# EasyEDA Pro project 智能环境检测系统.epro

# Schematic 原理图
Create Date: 2024-04-26; Page Name: P1; Project Name: WIFI  空气温湿度 oled 土壤 光敏; Schematic Name: 原理图; Update Date: 2024-10-24; Company: 嘉立创EDA; Page Size: A4; Version: V1.0
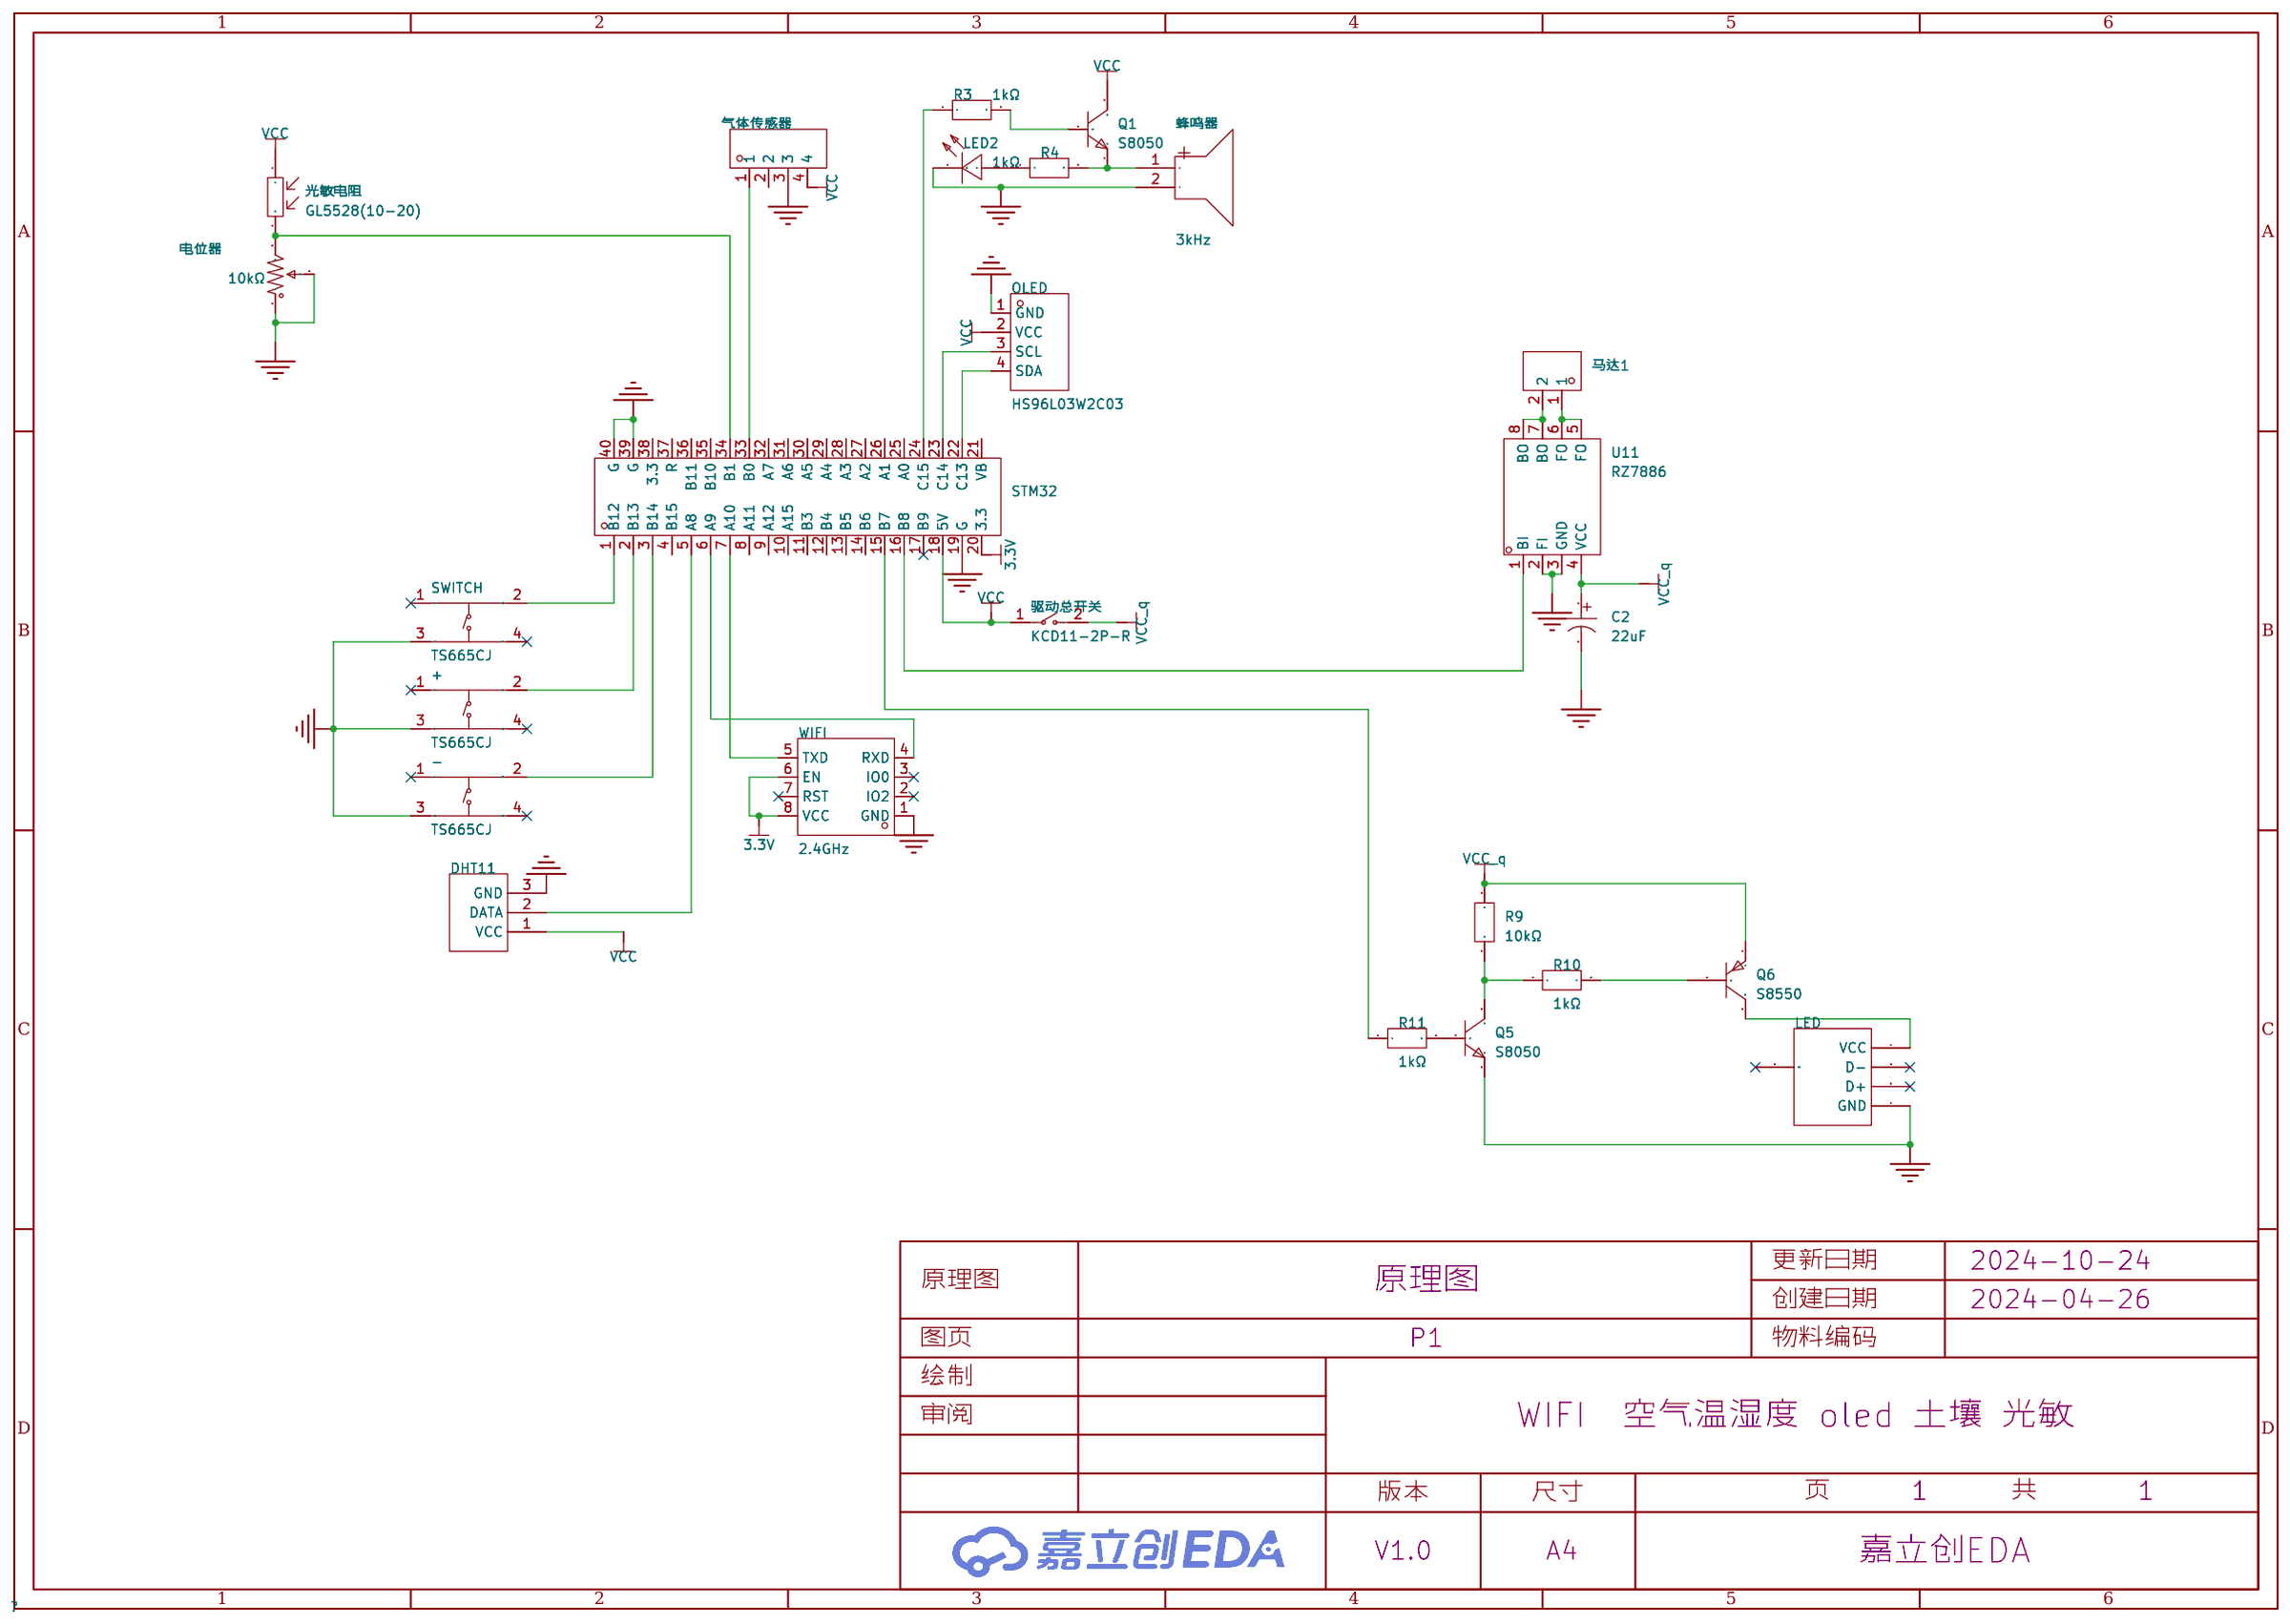
[diagram p0: schematic sheet]

## Parts
+  TS665CJ  [SW-TH_4P-L6.0-W6.0-P4.50-LS6.5]
-  TS665CJ  [SW-TH_4P-L6.0-W6.0-P4.50-LS6.5]
C2  22uF  [CAP-TH_BD5.0-P2.00-D0.8-FD]
DHT11  -  [HDR-M-2.54_1X3]
LED  AF 90° WJDG  [USB-A-TH_AF-WJDG]
LED2  204-10SDRD/S530-A3/F182-68  [LED-TH_BD4.0-P2.50-RD]
OLED  HS96L03W2C03  [OLED-TH_L27.8-W27.2-P2.54_C9900033791]
Q1  S8050  [TO-92-3_L4.5-W3.5-P1.27-L]
Q5  S8050  [TO-92-3_L4.5-W3.5-P1.27-L]
Q6  S8550  [TO-92-3_L4.5-W3.5-P1.27-L]
R3  1kΩ  [RES-TH_BD2.3-L6.5-P10.50-D0.5]
R4  1kΩ  [RES-TH_BD2.3-L6.5-P10.50-D0.5]
R9  10kΩ  [RES-TH_BD2.4-L6.3-P10.30-D0.6]
R10  1kΩ  [RES-TH_BD2.3-L6.5-P10.50-D0.5]
R11  1kΩ  [RES-TH_BD2.3-L6.5-P10.50-D0.5]
STM32  -  [DIP-40_L50.8-W17.8-P2.54-LS15.2-BL]
SWITCH  TS665CJ  [SW-TH_4P-L6.0-W6.0-P4.50-LS6.5]
U11  RZ7886  [DIP-8_L10.0-W6.5-P2.54-LS7.6-BL]
WIFI  2.4GHz  [WIFIM-TH_8P-L24.7-W14.4-P2.54]
光敏电阻  GL5528(10-20)  [RES-TH_L5.1-W4.3-P3.40-D0.5]
气体传感器  -  [HDR-TH_4P-P2.54-V-M]
电位器  10kΩ  [RES-ADJ-TH_3362P]
蜂鸣器  3kHz  [BUZ-TH_BD9.0-P5.00-D0.6-FD]
马达1  MX126-5.0-02P-GN01-Cu-S-A  [CONN-TH_2P-P5.00_MX126-5.0-GN01-02P-CU-S-A]
驱动总开关  KCD11-2P-R  [SW-TH_2P-L15.0-W10.5-P5.00_KCD11-2P-R]

## Library data of the parts
+ - SWITCH = TS665CJ: 电路结构:单刀单掷;按钮形状:圆形按钮;安装方式:直插;开关长度:6mm;开关宽度:6mm;开关高度:5mm;触点电流:50mA;额定电压(DC):12V;带灯:-;机械寿命:-;; LCSC Part Name: 6*6*5mm 直插 轻触开关; Supplier Part: C393938; Manufacturer: SHOU HAN(首韩); Supplier Footprint: 插件; JLCPCB Part Class: 扩展库; Datasheet: https://atta.szlcsc.com/upload/public/pdf/source/20190521/C393938_BDABEAC600B4C55E200A80AA129B70BC.pdf; Supplier: LCSC; Circuit: 单刀单掷; Actuator Style: 圆形按钮; Mounting Style: 直插; Switch Length: 6mm; Switch Width: 6mm; Switch Height: 5mm; Contact Current: 50mA; Voltage Rating (DC): 12V
C2 = KM220M050C110A: 容值:22uF;精度:±20%;额定电压:50V;; LCSC Part Name: 22uF ±20% 50V; Supplier Part: C59385; Manufacturer: CapXon(丰宾); Supplier Footprint: 插件,D5xL11mm; JLCPCB Part Class: 扩展库; Datasheet: https://atta.szlcsc.com/upload/public/pdf/source/20150922/1457707409519.pdf; Supplier: LCSC; Tolerance: ±20%; Rated Voltage: 50V; Lead Spacing: 2mm; φD: 5mm; L: 11mm; Lifetime @ Temp: 2000hrs@105℃
DHT11 = dht11模块
LED = AF 90° WJDG: 连接器类型:Type-A;标准:USB 2.0;公母:母;端口数量:1;触点数量:4P;安装方式:弯插;额定电流 - 电源:1.5A;工作温度范围:-25℃~+85℃;; LCSC Part Name: Type-A 母 弯插; Supplier Part: C456018; Manufacturer: SHOU HAN(首韩); Supplier Footprint: 插件; JLCPCB Part Class: 扩展库; Datasheet: https://atta.szlcsc.com/upload/public/pdf/source/20191113/C456018_B104E062BEB8E11E57E63560E04EE13A.pdf; Supplier: LCSC; Connector Type: Type-A; Standard: USB 2.0; Gender: 母; Number of Ports: 1; Number of Contacts: 4P; Mounting Style: 弯插; Current Rating - Power (Max): 1.5A; Operating Temperature Range: -25℃~+85℃
LED2 = 204-10SDRD/S530-A3/F182-68: Supplier Part: C473831; Manufacturer: EVERLIGHT(亿光); Supplier Footprint: 插件; JLCPCB Part Class: 扩展库; Supplier: LCSC
OLED = HS96L03W2C03: 主控芯片:SSD1315;接口类型:I2C;尺寸(inch):0.96;像素分辨率:128x64;; LCSC Part Name: 0.96寸OLED显示屏窄白光IIC; Supplier Part: C5248080; Manufacturer: HS(汉昇); JLCPCB Part Class: 扩展库; Datasheet: https://atta.szlcsc.com/upload/public/pdf/source/20230627/763D01F79A90007632F098068C7C8AD9.pdf; Supplier: LCSC; Main Control Chip: SSD1315; Interface Type: I2C; Size: 0.96; Pixel Resolution: 128x64; Operating Temperature: -40℃~+70℃
Q1 Q5 = S8050_C2931492: 晶体管类型:NPN;集电极电流(Ic):500mA;集射极击穿电压(Vceo):25V;功率(Pd):625mW;直流电流增益(hFE@Ic,Vce):160@50mA,1V;; LCSC Part Name: NPN 电流:500mA 耐压:25V; Supplier Part: C2931492; Manufacturer: JSMSEMI(杰盛微); Supplier Footprint: TO-92-3; JLCPCB Part Class: 扩展库; Datasheet: https://atta.szlcsc.com/upload/public/pdf/source/20240105/D4E57AD221AC7DEA1E31B953388D993E.pdf; Supplier: LCSC; Transistor Type: NPN; Collector Current (Ic): 500mA; Collector-Emitter Breakdown Voltage (Vceo): 25V; Power Dissipation (Pd): 625mW; DC Current Gain (hFE@Ic,Vce): 160@50mA,1V; Transition Frequency (fT): 150MHz; Collector Cut-Off Current (Icbo): 100nA; Collector-Emitter Saturation Voltage (VCE(sat)@Ic,Ib): 600mV@500mA,50mA
Q6 = S8550_C2931493: 晶体管类型:PNP;集电极电流(Ic):500mA;集射极击穿电压(Vceo):25V;功率(Pd):625mW;直流电流增益(hFE@Ic,Vce):160@50mA,1V;; LCSC Part Name: PNP 电流:500mA 耐压:25V; Supplier Part: C2931493; Manufacturer: JSMSEMI(杰盛微); Supplier Footprint: TO-92-3; JLCPCB Part Class: 扩展库; Datasheet: https://atta.szlcsc.com/upload/public/pdf/source/20240105/F52EC9AE03FE5F64272EDBFE24453978.pdf; Supplier: LCSC; Transistor Type: PNP; Collector Current (Ic): 500mA; Collector-Emitter Breakdown Voltage (Vceo): 25V; Power Dissipation (Pd): 625mW; DC Current Gain (hFE@Ic,Vce): 160@50mA,1V; Transition Frequency (fT): 150MHz; Collector Cut-Off Current (Icbo): 100nA; Collector-Emitter Saturation Voltage (VCE(sat)@Ic,Ib): 600mV@500mA,50mA
R3 R4 R10 R11 = MF1/4W-1KΩ±1%T52: 电阻类型:金属膜电阻;阻值:1kΩ;精度:±1%;功率:250mW;温度系数:±200ppm/℃;; LCSC Part Name: 金属膜电阻 1kΩ ±1% 250mW; Supplier Part: C713997; Manufacturer: 华星机电; Supplier Footprint: 插件; JLCPCB Part Class: 扩展库; Datasheet: https://atta.szlcsc.com/upload/public/pdf/source/20200731/C713882_AE8EB1102749D7E4FB4FB13DC898C429.pdf; Supplier: LCSC; Type: 金属膜电阻; Tolerance: ±1%; Power(Watts): 250mW; Temperature Coefficient: ±200ppm/℃
R9 = RN1/4W10KFT/BA1: 电阻类型:金属膜电阻;阻值:10kΩ;精度:±1%;功率:250mW;温度系数:±50ppm/℃;; LCSC Part Name: 10kΩ ±1% 250mW 金属膜电阻; Supplier Part: C410695; Manufacturer: Tyohm(幸亚电阻); Supplier Footprint: 插件; JLCPCB Part Class: 扩展库; Datasheet: https://atta.szlcsc.com/upload/public/pdf/source/20190808/C410699_D126E64D28B638F1D73B58E9F61DFD9B.pdf; Supplier: LCSC; Type: 金属膜电阻; Tolerance: ±1%; Overload Voltage (Max): 250V; Power(Watts): 250mW; Temperature Coefficient: ±50ppm/℃; Operating Temperature Range: -55℃~+125℃
STM32 = stm32扩展板
U11 = RZ7886: 马达驱动; Supplier Part: C128852; Manufacturer: RZ(睿智微); Supplier Footprint: DIP-8; JLCPCB Part Class: 扩展库; Datasheet: https://atta.szlcsc.com/upload/public/pdf/source/20180613/C128852_BAAE7924E869DB4853C0D962680B5688.pdf; Supplier: LCSC
WIFI = ESP-01S: 核心处理器:ESP8266芯片;频率:2.4GHz;天线形式:板载PCB天线;发射功率:16dBm;接收灵敏度:-90dBm;; LCSC Part Name: 完整的802.11b/g/nWi-FiSoC模块; Supplier Part: C503582; Manufacturer: Ai-Thinker(安信可); JLCPCB Part Class: 扩展库; Datasheet: https://atta.szlcsc.com/upload/public/pdf/source/20200407/C503582_1139AF8FB42E05635FA0089E1752A536.pdf; Supplier: LCSC; Core Processor: ESP8266芯片; Support Interface: GPIO；UART；PWM; Antenna Type: 板载PCB天线; Output Power: 16dBm; Operating Voltage: 3V~3.6V; Receive  Current: 56mA; Send  Current: 170mA; Sensitivity: -90dBm; Operating Temperature: -20℃~+70℃
光敏电阻 = GL5528(10-20)_C10081: 暗电阻:1MΩ;亮电阻 @ 10Lux:10kΩ~20kΩ;光谱峰值(波长):540nm;; LCSC Part Name: 亮电阻:10kΩ~20kΩ 暗电阻:1MΩ; Supplier Part: C10081; Manufacturer: JCHL(晶创和立); Supplier Footprint: 插件,P=3.4mm; JLCPCB Part Class: 扩展库; Datasheet: https://atta.szlcsc.com/upload/public/pdf/source/20200417/C515010_C10502EF7F431E893A7F20DB83F527F0.pdf; Supplier: LCSC; Dark Resistance: 1MΩ; Illuminated Resistance @ 10Lux: 10kΩ~20kΩ; Applied Voltage: 150V; Spectral Peak: 540nm
气体传感器 = HDR-M_2.54_1x4P: Supplier Part: C492403; Supplier Footprint: 插件
电位器 = 3362P-1-103: 阻值:10kΩ;精度:±10%;; LCSC Part Name: 10kΩ ±10%; Supplier Part: C118956; Manufacturer: BOCHEN(博晨); Supplier Footprint: 插件; JLCPCB Part Class: 扩展库; Datasheet: https://atta.szlcsc.com/upload/public/pdf/source/20171114/C118956_15106326650691117445.pdf; Supplier: LCSC; Tolerance: ±10%
蜂鸣器 = HNB09A03: 驱动方式:有源(内含驱动线路);构造类型:电磁式;频率:3kHz;声压(SPL):85dB@10cm;; LCSC Part Name: 电磁式有源一体蜂鸣器HNB09A03; Supplier Part: C96102; Manufacturer: 华能; Supplier Footprint: 插件,D=9mm; JLCPCB Part Class: 扩展库; Datasheet: https://atta.szlcsc.com/upload/public/pdf/source/20170522/1495448326172.pdf; Supplier: LCSC; Oscillator Circuit: 有源(内含驱动线路); Technology Type: 电磁式; Operating Voltage: 1.5V~4.5V; Current Consumption: 30mA; Sound Pressure Level (SPL): 85dB@10cm; Diameter (φD): 9mm; Height: 5.5mm; Operating Temperature: -20℃~+70℃
马达1 = MX126-5.0-02P-GN01-Cu-S-A: 结构:1x2P;间距:5mm;颜色:绿色;安装方式:直插;额定电流:10A;额定电压:300V;排数:1;线规 - AWG:14~26;线规 - 平方毫米:2.5;每排PIN数:2;触头材质:铜合金;触头镀层:锡;工作温度范围:-40℃~+105℃;; LCSC Part Name: 5mm 1x2P 排数:1 每排P数:2 直插; Supplier Part: C5188434; Manufacturer: MAX(迈旭); Supplier Footprint: 插件,P=5mm; JLCPCB Part Class: 扩展库; Datasheet: https://atta.szlcsc.com/upload/public/pdf/source/20230914/2B012B5258BE925E2417FA81B30CB923.pdf; Supplier: LCSC; Structure: 1x2P; Pitch: 5mm; Color: 绿色; Mounting Style: 直插; Current Rating (Max): 10A; Voltage Rating (Max): 300V; Number of Pins: 2P; Number of Rows: 1; Wire Gauge - AWG: 14~26; Wire Gauge - mm2: 2.5; Number of PINs Per Row: 2; Contact Material: 铜合金; Contact Plating: 锡; Operating Temperature Range: -40℃~+105℃
驱动总开关 = KCD11-2P-R: 带灯:无;引脚样式:焊片;额定电流:3A;额定电压(AC):250V;额定电压(DC):-;电路结构:单刀单掷;机械寿命:1万次;; LCSC Part Name: 10.5*15mm 两脚两档跷板开关 红钮; Supplier Part: C5884414; Manufacturer: SHOU HAN(首韩); Supplier Footprint: 插件; JLCPCB Part Class: 扩展库; Datasheet: https://atta.szlcsc.com/upload/public/pdf/source/20230506/CD06DFDE35C8048D34175BFF4AF6A2C2.pdf; Supplier: LCSC; Switch Length: 15mm; Switch Width: 10.5mm; Switch Height: 17.2mm; Actuator Type: 凹面弯曲; With Lamp: 无; Pin Style: 焊片; Actuator Color: 红色; Contact Current: 3A; Voltage Rating (AC): 250V; Circuit: 单刀单掷; Mechanical Life: 1万次; Operating Temperature: 0℃~+125℃; Actuator Identifier: - O

## Nets
3.3V: STM32.20(3.3) WIFI.6(EN) WIFI.8(VCC)
GND: +.3(C) -.3(C) C2.2 DHT11.3(GND) LED.4(GND) LED2.1(C) OLED.1(GND) Q5.1(E) STM32.19(G) STM32.39(G) STM32.40(G) SWITCH.3(C) U11.2(FI) U11.3(GND) WIFI.1(GND) 气体传感器.3 电位器.1 电位器.2 蜂鸣器.2(-)
VCC: DHT11.1(VCC) OLED.2(VCC) Q1.3(C) STM32.18(5V) 光敏电阻.1 气体传感器.4 驱动总开关.1
VCC_q: C2.1 Q6.1(E) R9.2 U11.4(VCC) 驱动总开关.2
$1N3228: STM32.33(B0) 气体传感器.1
$1N3444: Q1.2(B) R3.2
$1N3528: Q1.1(E) R4.2 蜂鸣器.1(+)
$1N3532: LED2.2(A) R4.1
$1N3767: OLED.3(SCL) STM32.23(C14)
$1N3771: OLED.4(SDA) STM32.22(C13)
$1N3839: R3.1 STM32.24(C15)
$1N4349: STM32.1(B12) SWITCH.2(B)
$1N4353: +.2(B) STM32.2(B13)
$1N4357: -.2(B) STM32.3(B14)
$1N4558: DHT11.2(DATA) STM32.5(A8)
$1N4725: STM32.6(A9) WIFI.4(RXD)
$1N4730: STM32.7(A10) WIFI.5(TXD)
$1N5233: Q6.2(B) R10.2
$1N5238: Q5.3(C) R9.1 R10.1
$1N5242: Q5.2(B) R11.2
$1N6355: R11.1 STM32.15(B7)
$1N6554: STM32.34(B1) 光敏电阻.2 电位器.3
$1N12132: LED.1(VCC) Q6.3(C)
$1N15975: STM32.16(B8) U11.1(BI)
$1N16897: U11.7(BO) U11.8(BO) 马达1.2
$1N16901: U11.5(FO) U11.6(FO) 马达1.1

Not connected (* = marked no-connect by the designer): + 1(A)* 4(D)*; - 1(A)* 4(D)*; LED 2(D-)* 3(D+)* 5(SHLD)*; STM32 4(B15) 8(A11) 9(A12) 10(A15) 11(B3) 12(B4) 13(B5) 14(B6) 17(B9)* 21(VB) 25(A0) 26(A1) 27(A2) 28(A3) 29(A4) 30(A5) 31(A6) 32(A7) 35(B10) 36(B11) 37(R) 38(3.3); SWITCH 1(A)* 4(D)*; WIFI 2(IO2)* 3(IO0)* 7(RST)*; 气体传感器 2

# Board 单层板
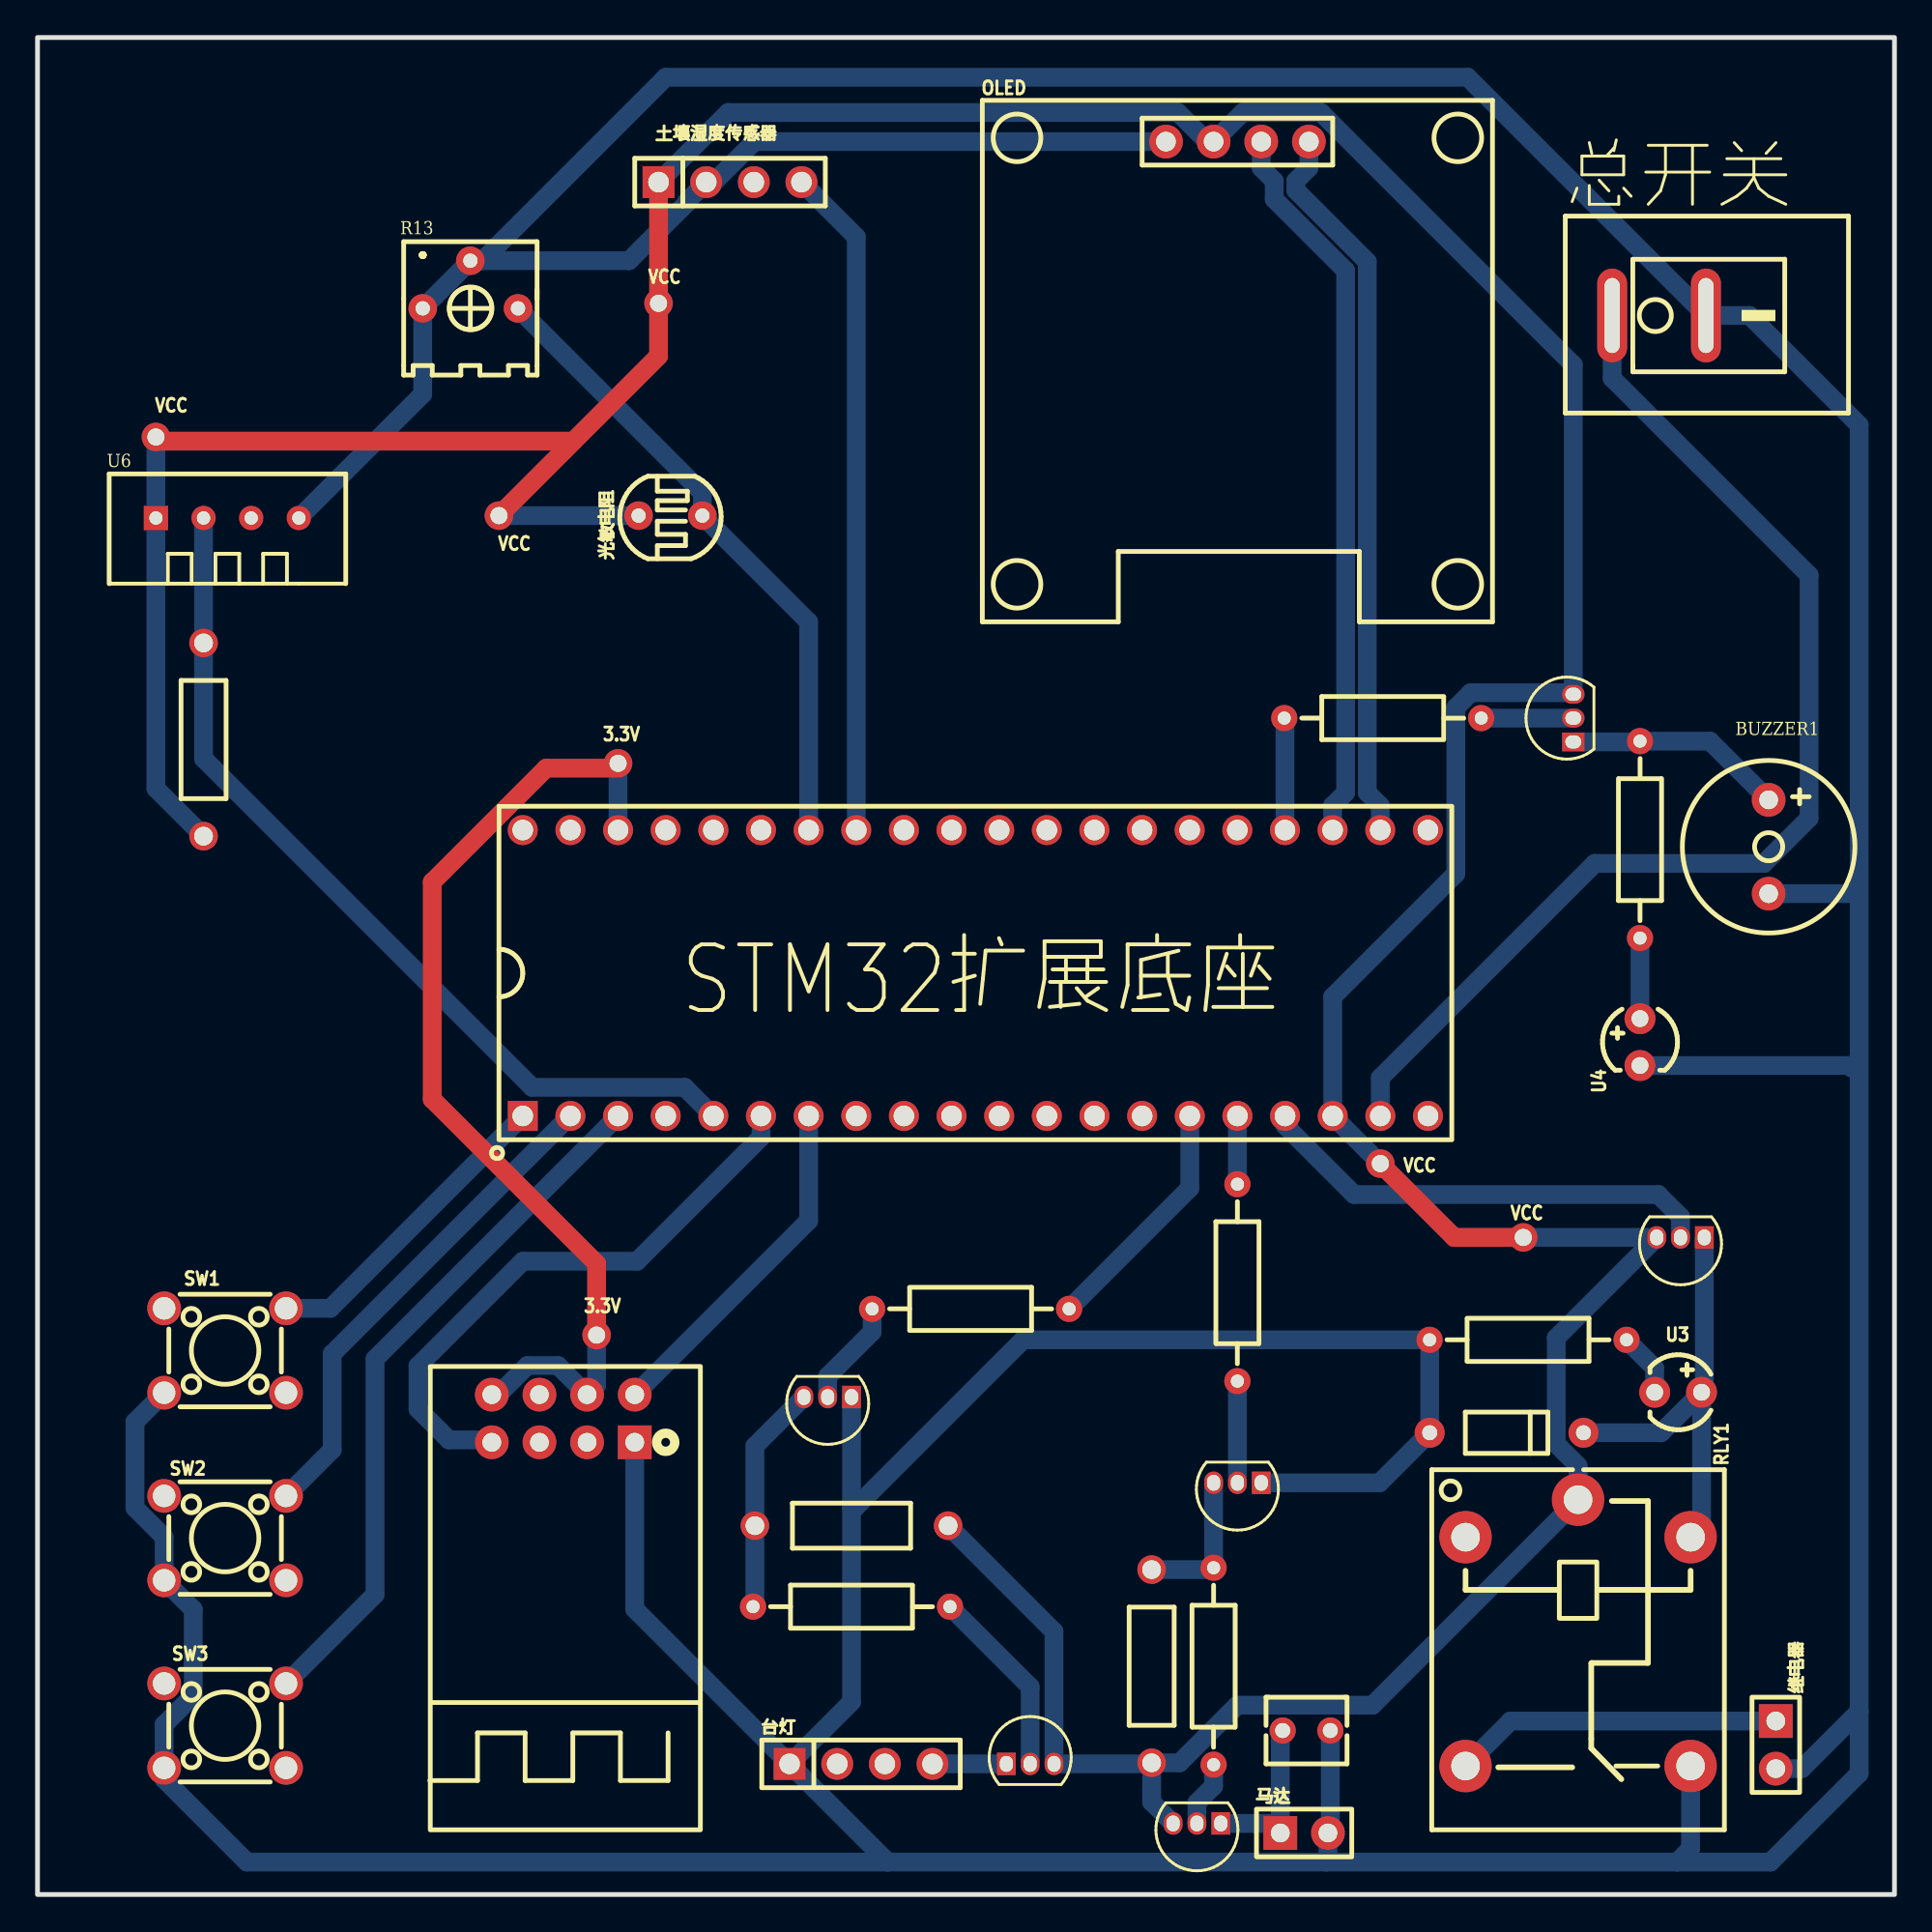
[diagram p1: board, top side]
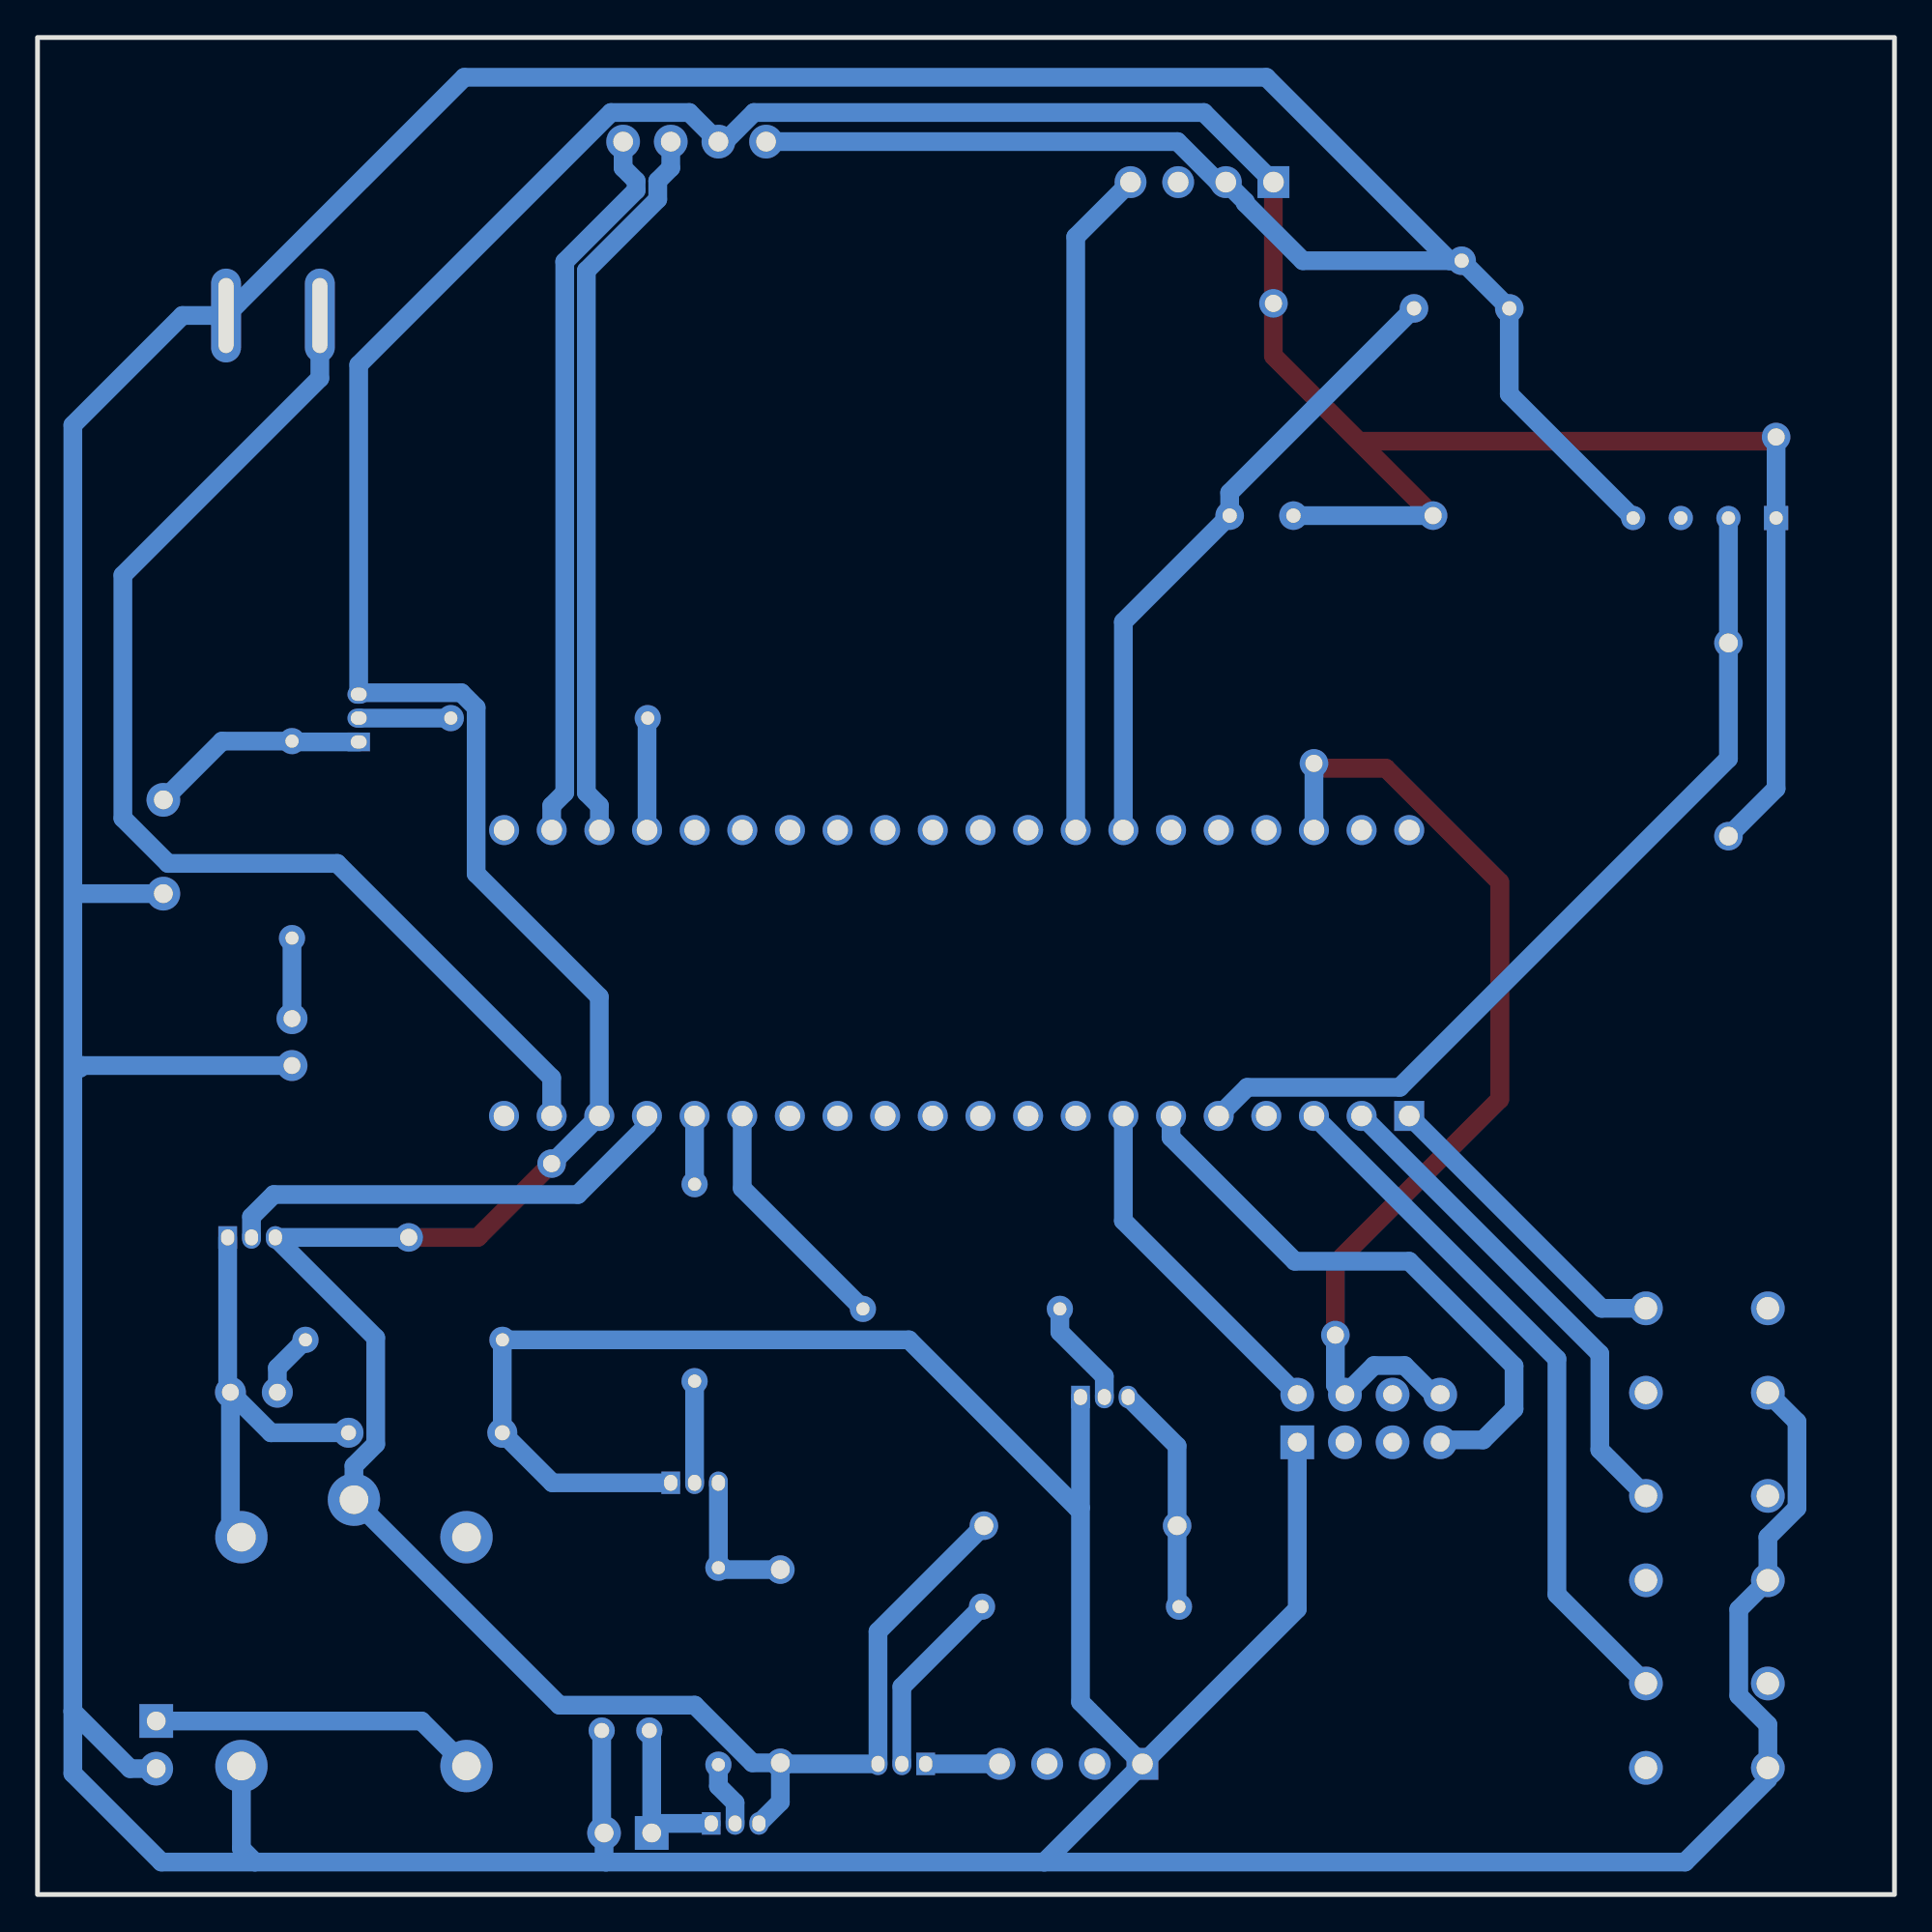
[diagram p2: board, bottom side, seen from below]

Outline 99 x 99 mm; copper layers: Top Layer, Bottom Layer. Coordinates in mm from the lower left corner of the outline.
Outline path: rectangle 0,99 99,0
Stack: Top Layer 0.035mm / Dielectric1 1.51mm FR4 er 4.5 / Bottom Layer 0.035mm

## Design rules (mm)
net $1N3767: DP1
net $1N3771: DP1
template: JLCPCB Capability(Two Layers Board)
spacing copperThickness1oz (default): track to track 0.102, other pairs 0.152 to 0.3
spacing copperThickness2oz: track to track 0.203, other pairs 0.152 to 0.3
track width copperThickness1oz (default): min 0.127, default 0.254, max 2.54
track width copperThickness2oz: min 0.203, default 0.254, max 2.54
differential pair differentialPair (default): width min 0.127, default 0.254, max 2.54; gap min 0.152, default 0.152
via viaSize (default): diameter min 0.5, default 0.61, max 10; hole min 0.3, default 0.305, max 6.3

## Placement (name value [footprint] x y rotation side)
BUZZER1  3kHz  [BUZ-TH_BD9.0-P5.00-D0.6-FD]  92.29 55.86 270 top
D1  1N4148  [DO-35_BD2.0-L4.2-P8.20-D0.5-RD]  78.32 24.62 180 top
NOREF  -  [Pad_e508]  6.31 77.7 0 top
NOREF#2  -  [Pad_e484]  30.95 60.3 0 top
NOREF#3  -  [Pad_e485]  29.81 29.82 0 top
NOREF#4  -  [Pad_e466]  71.59 38.97 0 top
NOREF#5  -  [Pad_e456]  79.21 35.03 0 top
NOREF#6  -  [Pad_e501]  33.11 84.83 0 top
NOREF#7  -  [Pad_e477]  24.6 73.51 0 top
OLED  HS96L03W2C03  [OLED-TH_L27.8-W27.2-P2.54_C9900033791]  63.97 93.45 0 top
Q1  S8050  [TO-92-3_L4.5-W3.5-P1.27-L]  81.88 62.72 90 top
Q2  S8050  [TO-92-3_L4.5-W3.5-P1.27-L]  61.81 3.79 180 top
Q3  S8050  [TO-92-3_L4.5-W3.5-P1.27-L]  63.97 21.95 180 top
Q4  S8050  [TO-92-3_L4.5-W3.5-P1.27-L]  52.92 6.96 0 top
Q5  S8050  [TO-92-3_L4.5-W3.5-P1.27-L]  42.13 26.52 180 top
Q6  S8050  [TO-92-3_L4.5-W3.5-P1.27-L]  87.59 35.03 180 top
R3  1kΩ  [RES-TH_BD2.3-L6.5-P10.50-D0.5]  71.72 62.72 0 top
R4  1kΩ  [RES-TH_BD2.3-L6.5-P10.50-D0.5]  85.43 56.24 90 top
R5  10kΩ  [RES-TH_BD2.4-L6.3-P10.30-D0.6]  8.85 61.57 270 top
R6  10kΩ  [RES-TH_BD2.4-L6.3-P10.30-D0.6]  59.4 12.17 270 top
R7  1kΩ  [RES-TH_BD2.3-L6.5-P10.50-D0.5]  62.7 12.17 270 top
R8  1kΩ  [RES-TH_BD2.3-L6.5-P10.50-D0.5]  63.97 32.62 270 top
R9  10kΩ  [RES-TH_BD2.4-L6.3-P10.30-D0.6]  43.4 19.66 0 top
R10  1kΩ  [RES-TH_BD2.3-L6.5-P10.50-D0.5]  43.4 15.34 0 top
R11  1kΩ  [RES-TH_BD2.3-L6.5-P10.50-D0.5]  49.75 31.22 180 top
R12  1kΩ  [RES-TH_BD2.3-L6.5-P10.50-D0.5]  79.46 29.57 180 top
R13  10kΩ  [RES-ADJ-TH_3362P]  23.08 85.83 0 top
RLY1  SRD-05VDC-SL-C  [RELAY-TH_SRD-XXVDC-XL-C]  82.13 13.95 270 top
SW1  TS665CJ  [SW-TH_4P-L6.0-W6.0-P4.50-LS6.5]  10 29 0 top
SW2  TS665CJ  [SW-TH_4P-L6.0-W6.0-P4.50-LS6.5]  10 19 0 top
SW3  TS665CJ  [SW-TH_4P-L6.0-W6.0-P4.50-LS6.5]  10 9 0 top
U1  -  [DIP-40_L50.8-W17.8-P2.54-LS15.2-BL]  50 49.13 0 top
U3  204-10SDRD/S530-A3/F182-68  [LED-TH_BD4.0-P2.50-RD]  87.47 26.78 0 top
U4  204-10SDRD/S530-A3/F182-68  [LED-TH_BD4.0-P2.50-RD]  85.43 45.44 90 top
U6  DHT11  [SENSOR-TH_DHT11]  10.12 73.38 0 top
U7  100nF  [CAP-TH_L4.2-W3.5-P2.54-D0.5]  67.65 8.74 0 top
WIFI  2.4GHz  [WIFIM-TH_8P-L24.7-W14.4-P2.54]  28.03 25.38 270 top
光敏电阻  GL5528(10-20)  [RES-TH_L5.1-W4.3-P3.40-D0.5]  33.74 73.51 90 top
台灯  -  [HDR-TH_4P-P2.54-V-F]  43.9 6.96 0 top
土壤湿度传感器  -  [HDR-TH_4P-P2.54-V-M]  36.92 91.29 0 top
总开关  KCD11-2P-R  [SW-TH_2P-L15.0-W10.5-P5.00_KCD11-2P-R]  86.45 84.18 0 top
继电器  -  [HDR-TH_2P-P2.54-V-M-1]  92.67 7.98 270 top
马达  -  [HDR-TH_2P-P2.54-V-M-1]  67.53 3.28 0 top

## Footprints (pads in the part's own frame, mm; a bottom-side part is the same pattern mirrored in y, then rotated)
BUZ-TH_BD9.0-P5.00-D0.6-FD
  round 1.8 hole 1: 1(-2.5,0) 2(2.5,0)
CAP-TH_L4.2-W3.5-P2.54-D0.5
  round 1.4 hole 0.8: 1(-1.27,0) 2(1.27,0)
DIP-40_L50.8-W17.8-P2.54-LS15.2-BL
  rect 1.6x1.6 hole 1.1: 1(-24.13,-7.62)
  round 1.6 hole 1.1: 2(-21.59,-7.62) 3(-19.05,-7.62) 4(-16.51,-7.62) 5(-13.97,-7.62) 6(-11.43,-7.62) 7(-8.89,-7.62) 8(-6.35,-7.62) 9(-3.81,-7.62) 10(-1.27,-7.62) 11(1.27,-7.62) 12(3.81,-7.62) 13(6.35,-7.62) 14(8.89,-7.62) 15(11.43,-7.62) 16(13.97,-7.62) 17(16.51,-7.62) 18(19.05,-7.62) 19(21.59,-7.62) 20(24.13,-7.62) 21(24.125,7.62) 22(21.587,7.62) 23(19.045,7.62) 24(16.505,7.62) 25(13.965,7.62) 26(11.425,7.62) 27(8.885,7.62) 28(6.345,7.62) 29(3.81,7.62) 30(1.27,7.62) 31(-1.27,7.62) 32(-3.81,7.62) 33(-6.35,7.62) 34(-8.89,7.62) 35(-11.43,7.62) 36(-13.97,7.62) 37(-16.51,7.62) 38(-19.05,7.62) 39(-21.59,7.62) 40(-24.13,7.62)
DO-35_BD2.0-L4.2-P8.20-D0.5-RD
  round 1.6 hole 0.8: 1(-4.1,0) 2(4.1,0)
HDR-TH_2P-P2.54-V-M-1
  rect 1.8x1.8 hole 1: 1(-1.27,0)
  round 1.8 hole 1: 2(1.27,0)
HDR-TH_4P-P2.54-V-F
  rect 1.7x1.7 hole 1.1: 1(-3.81,0)
  round 1.7 hole 1.1: 2(-1.27,0) 3(1.27,0) 4(3.81,0)
HDR-TH_4P-P2.54-V-M
  rect 1.7x1.7 hole 1.1: 1(-3.81,0)
  round 1.7 hole 1.1: 2(-1.27,0) 3(1.27,0) 4(3.81,0)
LED-TH_BD4.0-P2.50-RD
  round 1.651 hole 0.9: 1(-1.25,0) 2(1.25,0)
OLED-TH_L27.8-W27.2-P2.54_C9900033791
  round 1.8 hole 1.05: 1(-3.81,0) 2(-1.27,0) 3(1.27,0) 4(3.81,0)
Pad_e456
  round 1.524 hole 0.914: 3(0,0)
Pad_e466
  round 1.524 hole 0.914: 41(0,0)
Pad_e477
  round 1.524 hole 0.914: 42(0,0)
Pad_e484
  round 1.524 hole 0.914: 43(0,0)
Pad_e485
  round 1.524 hole 0.914: 44(0,0)
Pad_e501
  round 1.524 hole 0.914: 45(0,0)
Pad_e508
  round 1.524 hole 0.914: 46(0,0)
RELAY-TH_SRD-XXVDC-XL-C
  round 2.794 hole 1.524: 1(-5.1,-6) 2(7.1,-6) 3(7.1,6) 4(-5.1,6) 5(-7.1,0)
RES-ADJ-TH_3362P
  round 1.524 hole 0.762: 1(-2.54,-1.27) 2(0,1.27) 3(2.54,-1.27)
RES-TH_BD2.3-L6.5-P10.50-D0.5
  round 1.4 hole 0.7: 1(-5.25,0) 2(5.25,0)
RES-TH_BD2.4-L6.3-P10.30-D0.6
  round 1.524 hole 1: 1(-5.15,0) 2(5.15,0)
RES-TH_L5.1-W4.3-P3.40-D0.5
  round 1.524 hole 0.762: 1(0,1.7) 2(0,-1.7)
SENSOR-TH_DHT11
  rect 1.296x1.296 hole 0.711: 1(-3.81,0)
  round 1.296 hole 0.711: 2(-1.27,0) 3(1.27,0) 4(3.81,0)
SW-TH_2P-L15.0-W10.5-P5.00_KCD11-2P-R
  oval 1.6x5 hole 0.8x4: 1(-2.5,0) 2(2.5,0)
SW-TH_4P-L6.0-W6.0-P4.50-LS6.5
  round 1.8 hole 1.2: 1(-3.25,2.25) 2(3.25,2.25) 3(-3.25,-2.25) 4(3.25,-2.25)
TO-92-3_L4.5-W3.5-P1.27-L
  rect 1x1.2 hole 0.7x0.85: 1(-1.27,0)
  oval 1x1.2 hole 0.7x0.85: 2(0,0) 3(1.27,0)
WIFIM-TH_8P-L24.7-W14.4-P2.54
  rect 1.8x1.8 hole 1: 1(1.27,3.81)
  round 1.8 hole 1: 2(1.27,1.27) 3(1.27,-1.27) 4(1.27,-3.81) 5(-1.27,3.81) 6(-1.27,1.27) 7(-1.27,-1.27) 8(-1.27,-3.81)

## Nets
3.3V: NOREF#2.43 NOREF#3.44 U1.38 WIFI.6 WIFI.8
GND: BUZZER1.2 D1.2 OLED.1 Q3.1 Q5.1 R12.2 R13.1 R13.2 RLY1.3 SW1.3 SW2.3 SW3.3 U4.1 U6.4 U7.2 WIFI.1 台灯.1 土壤湿度传感器.2 总开关.2 继电器.2 马达.2
VCC: NOREF.46 NOREF#4.41 NOREF#5.3 NOREF#6.45 NOREF#7.42 OLED.2 Q1.3 Q2.3 Q4.3 Q6.3 R5.2 R6.2 R9.2 RLY1.5 U1.18 U6.1 光敏电阻.1 土壤湿度传感器.1
$1N3228: U1.33 土壤湿度传感器.4
$1N3444: Q1.2 R3.2
$1N3528: BUZZER1.1 Q1.1 R4.2
$1N3532: R4.1 U4.2
$1N3767: OLED.3 U1.23
$1N3771: OLED.4 U1.22
$1N3839: R3.1 U1.24
$1N4349: SW1.2 U1.1
$1N4353: SW2.2 U1.2
$1N4357: SW3.2 U1.3
$1N4558: R5.1 U1.5 U6.2
$1N4725: U1.6 WIFI.4
$1N4730: U1.7 WIFI.5
$1N4882: Q2.2 R7.2
$1N4960: Q3.3 R6.1 R7.1
$1N4998: Q3.2 R8.2
$1N5233: Q4.2 R10.2
$1N5238: Q5.3 R9.1 R10.1
$1N5242: Q5.2 R11.2
$1N5278: U1.19 总开关.1
$1N5476: Q4.1 台灯.4
$1N5643: Q2.1 U7.1 马达.1
$1N6058: R12.1 U3.1
$1N6194: RLY1.2 继电器.1
$1N6226: D1.1 Q6.1 RLY1.4 U3.2
$1N6324: R8.1 U1.16
$1N6346: Q6.2 U1.17
$1N6355: R11.1 U1.15
$1N6554: R13.3 U1.34 光敏电阻.2

Pads without a net: RLY1 1; SW1 1 4; SW2 1 4; SW3 1 4; U1 4 8 9 10 11 12 13 14 20 21 25 26 27 28 29 30 31 32 35 36 37 39 40; U6 3; WIFI 2 3 7; 台灯 2 3; 土壤湿度传感器 3

## Routing (per net, layer and track width the routed paths; a pad name or vN(x,y) marks a point on that pad's centre or on a via; arc(x,y) is an arc through that point)
3.3V: length 53.6
  Top Layer w1: NOREF#3.44 29.81,33.63 21.04,42.4 21.04,53.97 27.12,60.05 30.7,60.05 NOREF#2.43
  Bottom Layer w1: NOREF#3.44 29.81,27.16 WIFI.6 27.75,28.2 26.12,28.2 24.56,26.65 WIFI.8 ; U1.38 NOREF#2.43
GND: length 464.3
  Bottom Layer w1: U4.1 96.59,44.19 96.74,44.05 ; 97.12,9.76 94.06,6.71 继电器.2 ; 97.12,9.76 97.12,78.34 91.28,84.18 总开关.2 76.25,96.88 33.49,96.88 23.71,87.1 ; 97.12,9.76 97.12,6.46 92.39,1.73 87.41,1.73 ; 68.7,1.73 87.41,1.73 ; 68.7,1.73 45.33,1.73 ; 68.7,1.73 68.8,1.82 马达.2 68.92,3.41 U7.2 ; 87.41,1.73 88.13,2.45 RLY1.3 ; 23.71,87.1 31.54,87.1 34.61,90.17 34.61,90.25 土壤湿度传感器.2 36.06,91.29 38.22,93.45 OLED.1 ; 23.71,87.1 R13.2 R13.1 20.54,79.99 U6.4 ; Q3.1 71.55,21.95 D1.2 74.22,29.56 R12.2 52.54,29.57 43.59,20.62 43.4,20.62 ; 台灯.1 45.33,1.73 ; 台灯.1 43.4,10.26 43.4,20.62 ; 台灯.1 31.84,15.22 WIFI.1 ; 45.33,1.73 11.17,1.73 6.75,6.14 SW3.3 6.75,9.06 8.3,10.61 8.3,15.2 SW2.3 6.75,19.06 5.2,20.61 5.2,25.2 SW1.3 ; 43.4,20.62 Q5.1 ; 96.86,53.32 96.82,53.36 BUZZER1.2
VCC: length 268.4
  Top Layer w1: NOREF.46 6.53,77.48 28.57,77.48 ; 28.57,77.48 NOREF#7.42 ; 28.57,77.48 33.11,82.02 NOREF#6.45 土壤湿度传感器.1 ; NOREF#5.3 75.53,35.03 NOREF#4.41
  Bottom Layer w1: NOREF#7.42 光敏电阻.1 ; R6.2 59.34,6.96 Q4.3 54.19,14.02 R9.2 ; R6.2 60.89,7.02 63.96,10.09 71.18,10.09 RLY1.5 82.13,22.85 80.97,24.01 80.97,29.68 Q6.3 NOREF#5.3 ; R6.2 59.4,4.93 Q2.3 ; NOREF#4.41 69.05,41.51 69.05,47.86 75.62,54.42 75.62,63.28 76.41,64.07 81.79,64.07 Q1.3 81.88,81.55 68.42,95 64.25,95 OLED.2 62.35,93.45 60.8,95 36.82,95 土壤湿度传感器.1 ; 8.85,56.42 6.31,58.96 U6.1 NOREF.46
$1N3228: length 35.8
  Bottom Layer w1: U1.33 43.65,88.37 土壤湿度传感器.4
$1N3444: length 4.9
  Bottom Layer w1: R3.2 Q1.2
$1N3528: length 11.7
  Bottom Layer w1: BUZZER1.1 89.16,61.49 R4.2 85.39,61.45 Q1.1
$1N3532: length 4.3
  Bottom Layer w1: U4.2 R4.1
$1N3767: length 38.9
  Bottom Layer w1: OLED.3 65.24,92.05 65.93,91.36 65.93,90.38 69.74,86.57 69.74,58.74 69.04,58.05 69.04,56.75
$1N3771: length 38.9
  Bottom Layer w1: OLED.4 67.78,92.05 67.09,91.36 67.09,90.86 70.89,87.05 70.89,58.74 71.59,58.05 U1.22
$1N3839: length 6
  Bottom Layer w1: R3.1 66.5,62.68 U1.24
$1N4349: length 16.9
  Bottom Layer w1: SW1.2 15.61,31.25 25.87,41.51
$1N4353: length 26.5
  Bottom Layer w1: 28.41,41.51 28.39,41.51 15.71,28.82 15.71,23.71 SW2.2
$1N4357: length 37.6
  Bottom Layer w1: SW3.2 18,16 18,28.55 30.95,41.51
$1N4558: length 47.9
  Bottom Layer w1: 36.03,41.51 34.51,43.03 26.38,43.03 8.85,60.56 R5.1 U6.2
$1N4725: length 31.4
  Bottom Layer w1: 38.57,41.51 38.57,40.36 31.97,33.76 25.87,33.76 20.28,28.17 20.28,25.89 21.93,24.24 24.09,24.24 WIFI.4
$1N4730: length 18.7
  Bottom Layer w1: WIFI.5 41.11,35.92 41.11,41.51
$1N4882: length 3.5
  Bottom Layer w1: R7.2 62.7,5.78 61.81,4.89 Q2.2
$1N4960: length 7.9
  Bottom Layer w1: R6.1 62.6,17.32 R7.1 Q3.3
$1N4998: length 5.4
  Bottom Layer w1: R8.2 Q3.2
$1N5233: length 10.2
  Bottom Layer w1: Q4.2 52.92,11.07 R10.2
$1N5238: length 12.3
  Bottom Layer w1: Q5.3 38.25,23.91 R9.1 38.25,15.44 R10.1
$1N5242: length 5.7
  Bottom Layer w1: R11.2 44.5,29.99 42.13,27.62 Q5.2
$1N5278: length 61.8
  Bottom Layer w1: 71.59,41.51 71.59,43.54 83.02,54.97 92.04,54.97 94.45,57.38 94.45,70.34 83.95,80.84 总开关.1
$1N5476: length 3.9
  Bottom Layer w1: 51.65,6.96 台灯.4
$1N5643: length 8.9
  Bottom Layer w1: 66.38,8.74 66.26,8.61 马达.1 65.75,3.79 63.08,3.79
$1N6058: length 3.4
  Bottom Layer w1: U3.1 86.22,28.07 R12.1
$1N6194: length 17.5
  Bottom Layer w1: 92.67,9.25 78.53,9.25 RLY1.2
$1N6226: length 23.5
  Bottom Layer w1: U3.2 86.56,24.62 D1.1 ; U3.2 88.72,19.63 RLY1.4 ; U3.2 88.86,26.92 Q6.1
$1N6324: length 3.6
  Bottom Layer w1: 63.97,41.51 R8.1
$1N6346: length 24.7
  Bottom Layer w1: 66.51,41.51 66.51,41 70.19,37.32 86.41,37.32 87.59,36.13 Q6.2
$1N6355: length 13
  Bottom Layer w1: 61.43,41.51 61.43,37.65 R11.1
$1N6554: length 34.2
  Bottom Layer w1: U1.34 41.11,67.84 光敏电阻.2 35.44,74.73 R13.3

## Text on the board
Document Layer: 红线代表飞线，只打印底层就行
Top Silkscreen Layer: VCC | 3.3V | STM32扩展底座

# Board 双层板
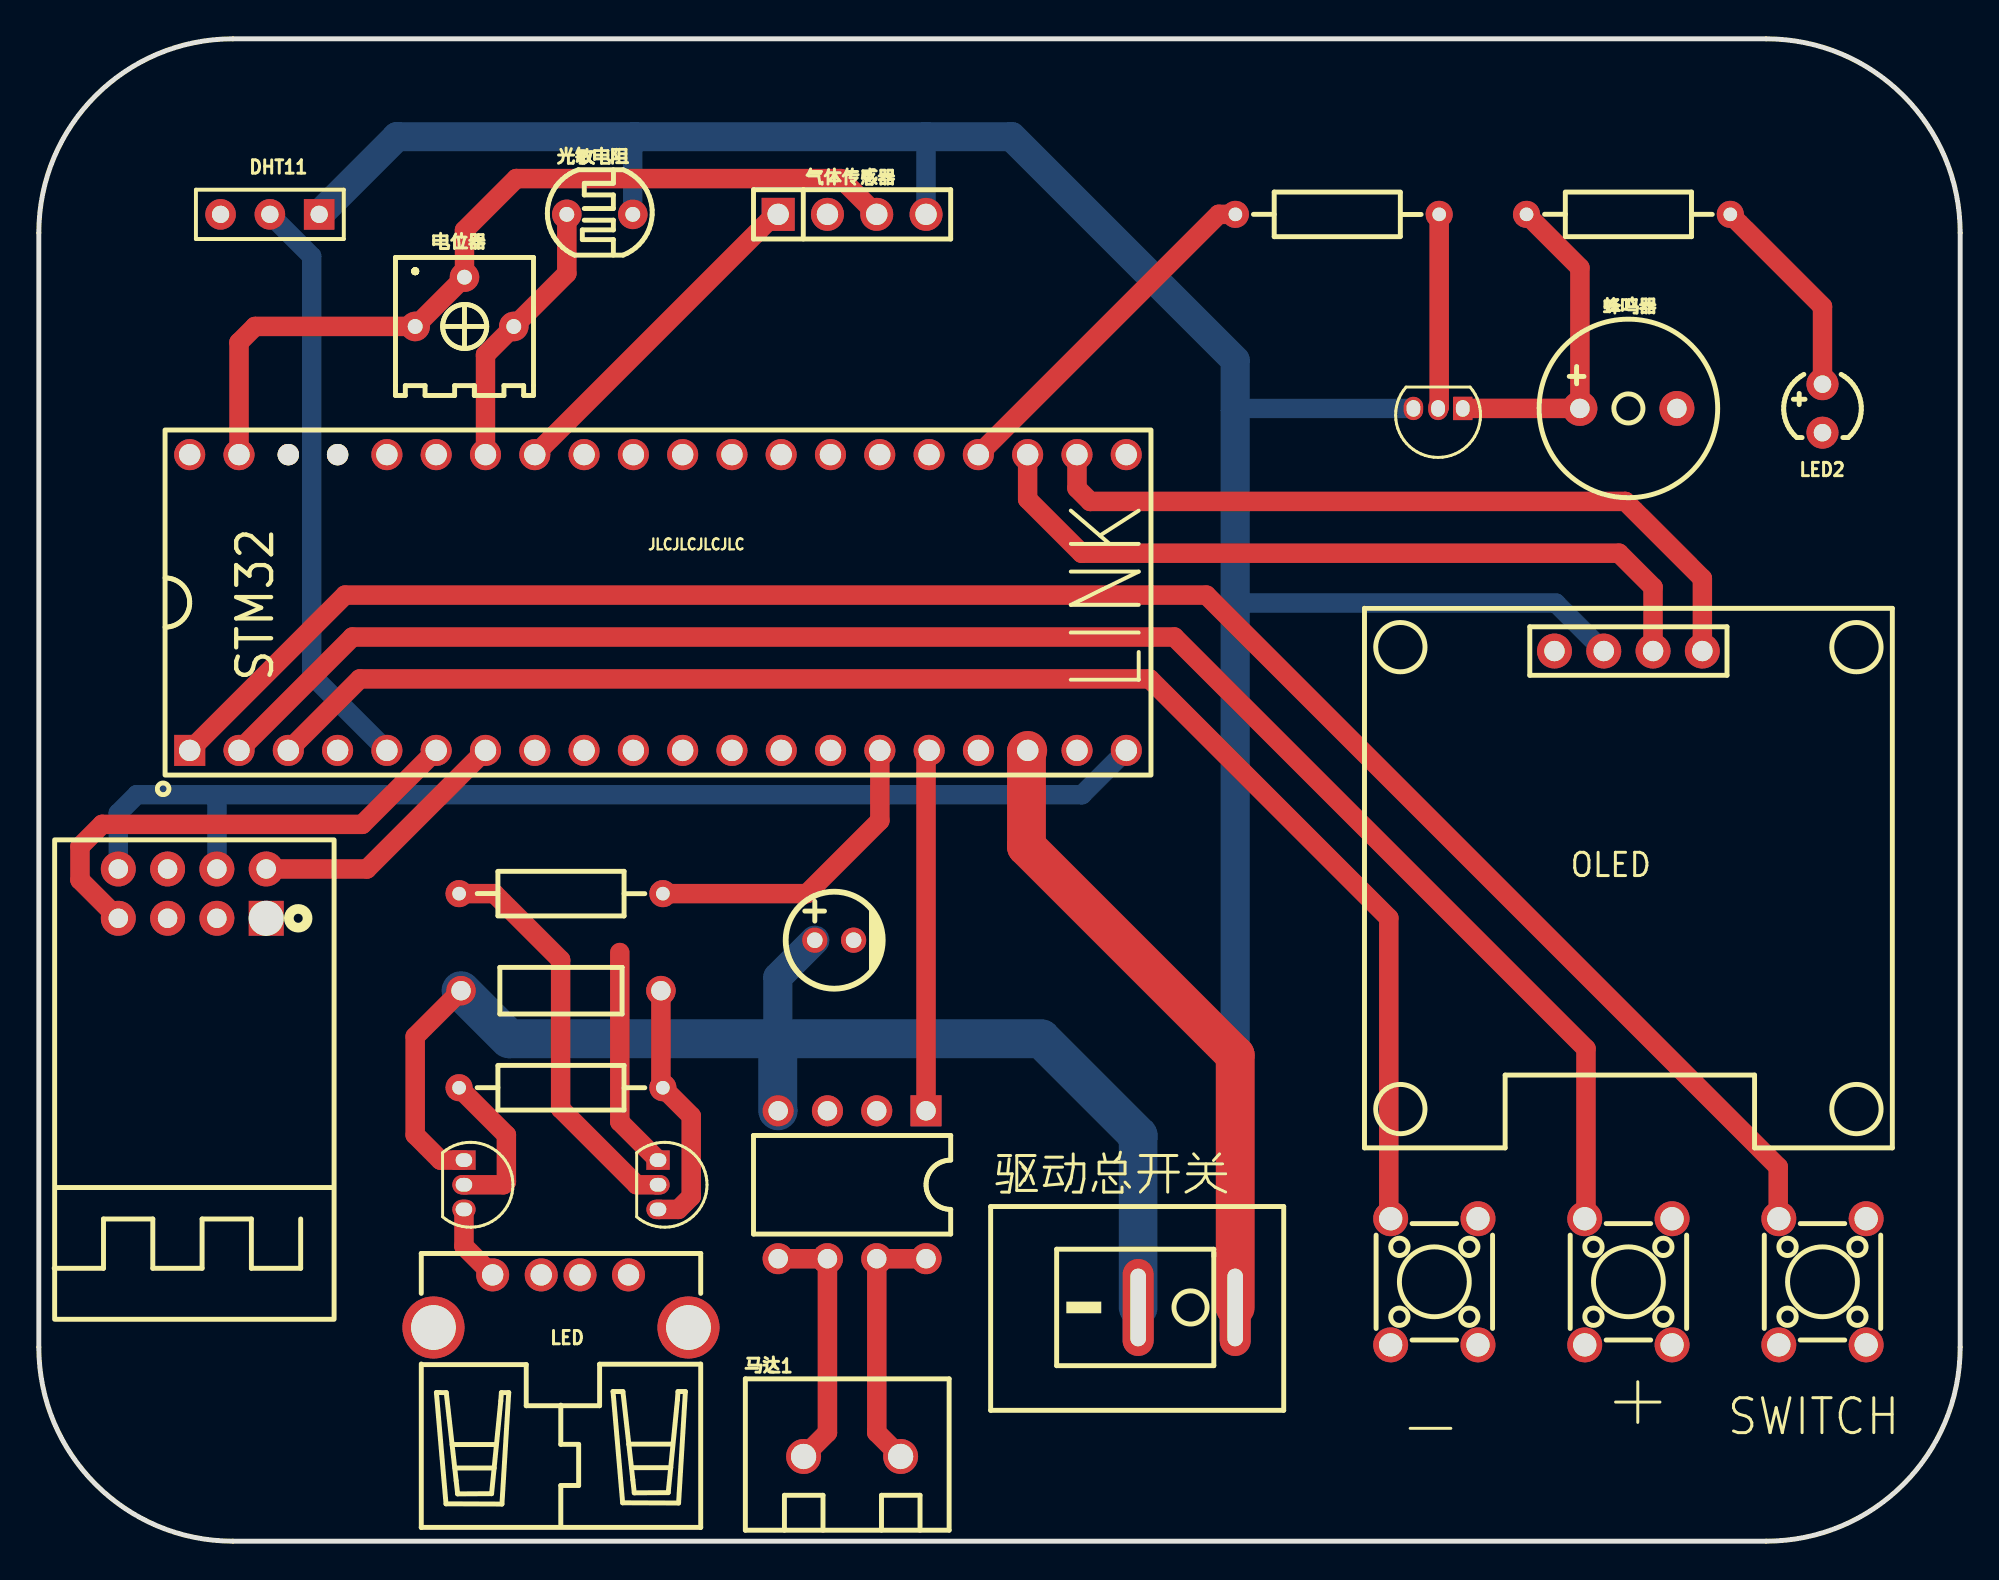
[diagram p3: board, top side]
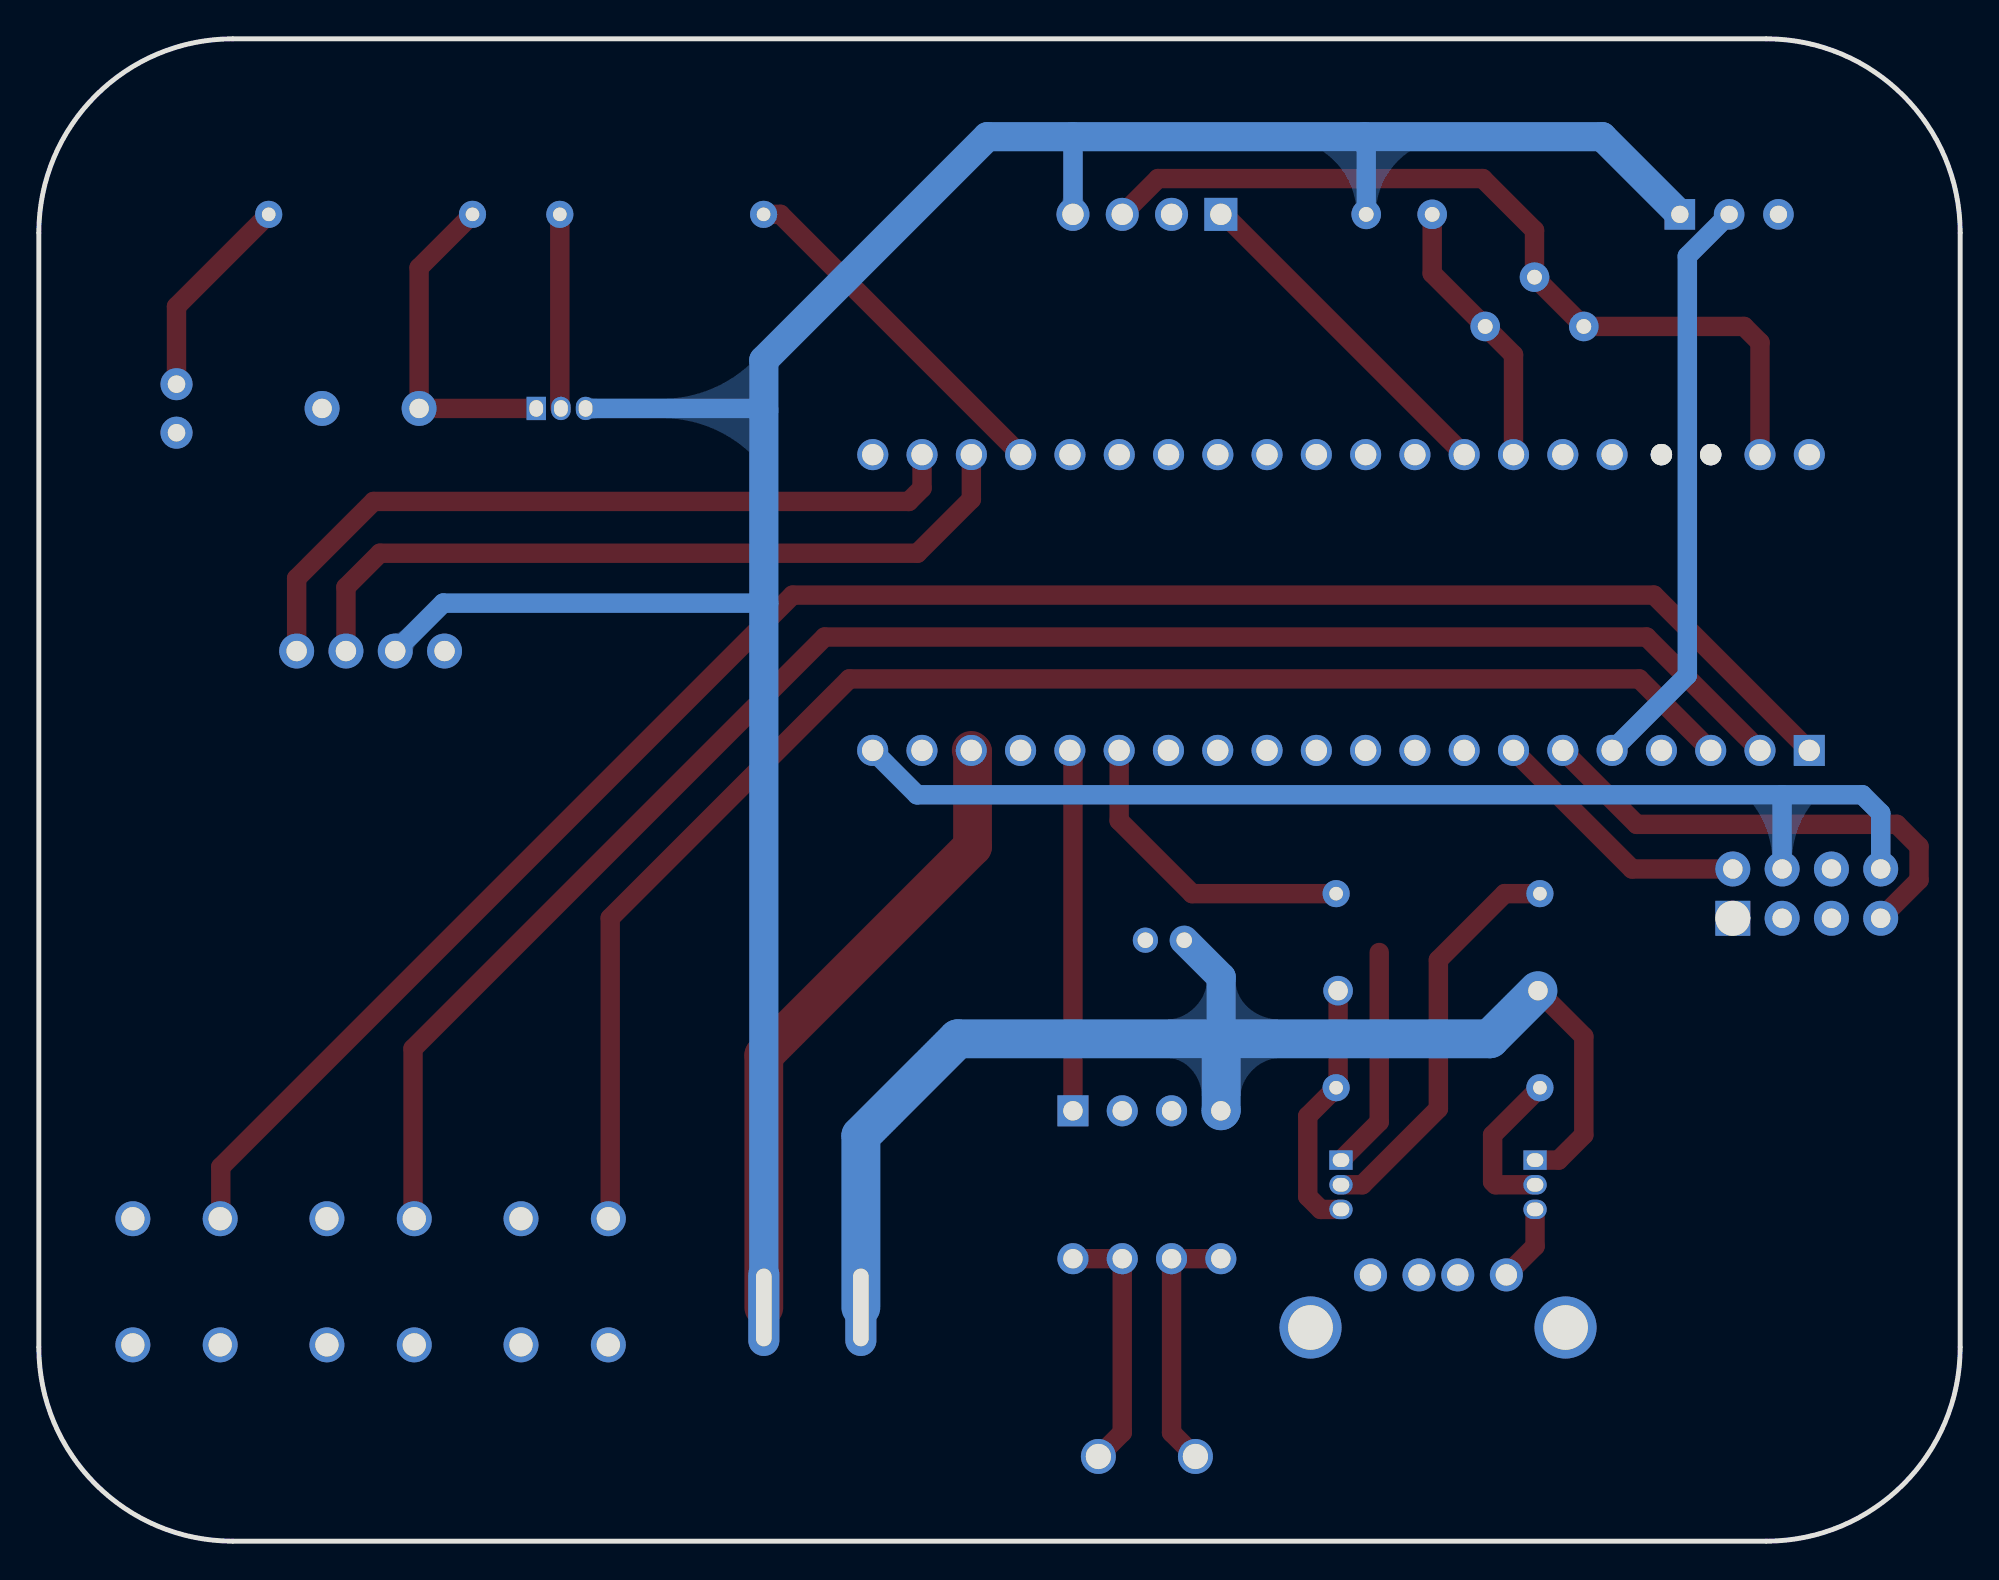
[diagram p4: board, bottom side, seen from below]

Outline 99 x 77.41 mm; copper layers: Top Layer, Bottom Layer. Coordinates in mm from the lower left corner of the outline.
Outline path: 0,67.41 0,10 arc(2.93,2.93) 10,0 89,0 arc(96.07,2.93) 99,10 99,67.41 arc(96.07,74.48) 89,77.41 10,77.41 arc(2.93,74.48) 0,67.41
Stack: Top Layer 0.035mm / Dielectric1 1.51mm FR4 er 4.5 / Bottom Layer 0.035mm

## Design rules (mm)
net $1N3767: DP1
net $1N3771: DP1
template: JLCPCB Capability(Two Layers Board)
spacing copperThickness1oz (default): track to track 0.102, other pairs 0.152 to 0.3
spacing copperThickness2oz: track to track 0.203, other pairs 0.152 to 0.3
track width copperThickness1oz (default): min 0.127, default 0.254, max 2.54
track width copperThickness2oz: min 0.203, default 0.254, max 2.54
differential pair differentialPair (default): width min 0.127, default 0.254, max 2.54; gap min 0.152, default 0.152
via viaSize (default): diameter min 0.5, default 0.61, max 10; hole min 0.3, default 0.305, max 6.3

## Placement (name value [footprint] x y rotation side)
+  TS665CJ  [SW-TH_4P-L6.0-W6.0-P4.50-LS6.5]  81.91 13.37 90 top
-  TS665CJ  [SW-TH_4P-L6.0-W6.0-P4.50-LS6.5]  71.91 13.37 90 top
C2  22uF  [CAP-TH_BD5.0-P2.00-D0.8-FD]  40.98 30.97 0 top
DHT11  -  [HDR-M-2.54_1X3]  11.91 68.37 180 top
LED  AF 90° WJDG  [USB-A-TH_AF-WJDG]  26.91 12.37 0 top
LED2  204-10SDRD/S530-A3/F182-68  [LED-TH_BD4.0-P2.50-RD]  91.91 58.37 90 top
OLED  HS96L03W2C03  [OLED-TH_L27.8-W27.2-P2.54_C9900033791]  81.91 45.87 0 top
Q1  S8050  [TO-92-3_L4.5-W3.5-P1.27-L]  72.1 58.37 180 top
Q5  S8050  [TO-92-3_L4.5-W3.5-P1.27-L]  31.91 18.37 270 top
Q6  S8550  [TO-92-3_L4.5-W3.5-P1.27-L]  21.91 18.37 270 top
R3  1kΩ  [RES-TH_BD2.3-L6.5-P10.50-D0.5]  66.91 68.37 0 top
R4  1kΩ  [RES-TH_BD2.3-L6.5-P10.50-D0.5]  81.91 68.37 180 top
R9  10kΩ  [RES-TH_BD2.4-L6.3-P10.30-D0.6]  26.91 28.37 180 top
R10  1kΩ  [RES-TH_BD2.3-L6.5-P10.50-D0.5]  26.91 23.37 180 top
R11  1kΩ  [RES-TH_BD2.3-L6.5-P10.50-D0.5]  26.91 33.37 180 top
STM32  -  [dip-40_l50.8-w17.8-p2.54-ls15.2-bl]  31.91 48.37 0 top
SWITCH  TS665CJ  [SW-TH_4P-L6.0-W6.0-P4.50-LS6.5]  91.91 13.37 90 top
U11  RZ7886  [DIP-8_L10.0-W6.5-P2.54-LS7.6-BL]  41.91 18.37 180 top
WIFI  2.4GHz  [wifim-th_8p-l24.7-w14.4-p2.54]  7.91 33.37 270 top
光敏电阻  GL5528(10-20)  [RES-TH_L5.1-W4.3-P3.40-D0.5]  28.91 68.37 270 top
气体传感器  -  [HDR-TH_4P-P2.54-V-M]  41.91 68.37 0 top
电位器  10kΩ  [RES-ADJ-TH_3362P]  21.93 63.86 0 top
蜂鸣器  3kHz  [BUZ-TH_BD9.0-P5.00-D0.6-FD]  81.91 58.37 0 top
马达1  MX126-5.0-02P-GN01-Cu-S-A  [CONN-TH_2P-P5.00_MX126-5.0-GN01-02P-CU-S-A]  41.91 4.37 0 top
驱动总开关  KCD11-2P-R  [SW-TH_2P-L15.0-W10.5-P5.00_KCD11-2P-R]  59.14 12.04 180 top

## Footprints (pads in the part's own frame, mm; a bottom-side part is the same pattern mirrored in y, then rotated)
BUZ-TH_BD9.0-P5.00-D0.6-FD
  round 1.8 hole 1: 1(-2.5,0) 2(2.5,0)
CAP-TH_BD5.0-P2.00-D0.8-FD
  round 1.3 hole 0.8: 1(-1,0) 2(1,0)
CONN-TH_2P-P5.00_MX126-5.0-GN01-02P-CU-S-A
  round 1.8 hole 1.3: 1(-2.5,0) 2(2.5,0)
DIP-8_L10.0-W6.5-P2.54-LS7.6-BL
  rect 1.6x1.6 hole 1: 1(-3.81,-3.81)
  round 1.6 hole 1: 2(-1.27,-3.81) 3(1.27,-3.81) 4(3.81,-3.81) 5(3.81,3.81) 6(1.27,3.81) 7(-1.27,3.81) 8(-3.81,3.81)
dip-40_l50.8-w17.8-p2.54-ls15.2-bl
  rect 1.6x1.6 hole 1.1: 1(-24.13,-7.62)
  round 1.6 hole 1.1: 2(-21.59,-7.62) 3(-19.05,-7.62) 4(-16.51,-7.62) 5(-13.97,-7.62) 6(-11.43,-7.62) 7(-8.89,-7.62) 8(-6.35,-7.62) 9(-3.81,-7.62) 10(-1.27,-7.62) 11(1.27,-7.62) 12(3.81,-7.62) 13(6.35,-7.62) 14(8.89,-7.62) 15(11.43,-7.62) 16(13.97,-7.62) 17(16.51,-7.62) 18(19.05,-7.62) 19(21.59,-7.62) 20(24.13,-7.62) 21(24.125,7.62) 22(21.587,7.62) 23(19.045,7.62) 24(16.505,7.62) 25(13.965,7.62) 26(11.425,7.62) 27(8.885,7.62) 28(6.345,7.62) 29(3.81,7.62) 30(1.27,7.62) 31(-1.27,7.62) 32(-3.81,7.62) 33(-6.35,7.62) 34(-8.89,7.62) 35(-11.43,7.62) 36(-13.97,7.62) 39(-21.59,7.62) 40(-24.13,7.62)
  round 1.1 hole 1.1: 37(-16.51,7.62) 38(-19.05,7.62)
HDR-M-2.54_1X3
  rect 1.575x1.575 hole 0.889: 1(-2.54,0)
  round 1.575 hole 0.889: 2(0,0) 3(2.54,0)
HDR-TH_4P-P2.54-V-M
  rect 1.7x1.7 hole 1.1: 1(-3.81,0)
  round 1.7 hole 1.1: 2(-1.27,0) 3(1.27,0) 4(3.81,0)
LED-TH_BD4.0-P2.50-RD
  round 1.651 hole 0.9: 1(-1.25,0) 2(1.25,0)
OLED-TH_L27.8-W27.2-P2.54_C9900033791
  round 1.8 hole 1.05: 1(-3.81,0) 2(-1.27,0) 3(1.27,0) 4(3.81,0)
RES-ADJ-TH_3362P
  round 1.524 hole 0.762: 1(-2.54,-1.27) 2(0,1.27) 3(2.54,-1.27)
RES-TH_BD2.3-L6.5-P10.50-D0.5
  round 1.4 hole 0.7: 1(-5.25,0) 2(5.25,0)
RES-TH_BD2.4-L6.3-P10.30-D0.6
  round 1.524 hole 1: 1(-5.15,0) 2(5.15,0)
RES-TH_L5.1-W4.3-P3.40-D0.5
  round 1.524 hole 0.762: 1(0,1.7) 2(0,-1.7)
SW-TH_2P-L15.0-W10.5-P5.00_KCD11-2P-R
  oval 1.6x5 hole 0.8x4: 1(-2.5,0) 2(2.5,0)
SW-TH_4P-L6.0-W6.0-P4.50-LS6.5
  round 1.8 hole 1.2: 1(-3.25,2.25) 2(3.25,2.25) 3(-3.25,-2.25) 4(3.25,-2.25)
TO-92-3_L4.5-W3.5-P1.27-L
  rect 1x1.2 hole 0.7x0.85: 1(-1.27,0)
  oval 1x1.2 hole 0.7x0.85: 2(0,0) 3(1.27,0)
USB-A-TH_AF-WJDG
  round 1.7 hole 1.1: 1(-3.521,1.355) 2(-1.018,1.355) 3(0.981,1.355) 4(3.48,1.355)
  round 3.2 hole 2.3: 5(-6.57,-1.355) 5(6.57,-1.355)
wifim-th_8p-l24.7-w14.4-p2.54
  rect 1.8x1.8 hole 1x2: 1(1.27,3.81)
  round 1.8 hole 1: 2(1.27,1.27) 3(1.27,-1.27) 4(1.27,-3.81) 5(-1.27,3.81) 6(-1.27,1.27) 7(-1.27,-1.27) 8(-1.27,-3.81)

## Nets
As in the schematic, except:
VCC_Q: C2.1 Q6.1 R9.2 U11.4 驱动总开关.2

Pads without a net: + 1 4; - 1 4; LED 2 3 5; STM32 4 8 9 10 11 12 13 14 17 21 25 26 27 28 29 30 31 32 35 36 37 38; SWITCH 1 4; WIFI 2 3 7; 气体传感器 2

## Routing (per net, layer and track width the routed paths; a pad name or vN(x,y) marks a point on that pad's centre or on a via; arc(x,y) is an arc through that point)
3.3V: length 60
  Bottom Layer w1: 9.18,38.46 53.75,38.46 STM32.20 ; 9.18,38.46 5.04,38.46 4.09,37.51 WIFI.8 ; 9.18,38.46 9.17,38.45 WIFI.6
GND: length 55.8
  Top Layer w1: 29.93,30.33 29.93,21.61 Q5.1 ; STM32.39 10.31,61.77 11.14,62.59 电位器.1 电位器.2 21.93,67.54 24.6,70.21 41.33,70.21 气体传感器.3
VCC: length 172.9
  Top Layer w2: 驱动总开关.1 61.64,25.04 50.89,35.79 50.89,40.68 STM32.18
  Bottom Layer w1: OLED.2 78.17,48.33 61.64,48.33 ; 61.64,58.27 61.74,58.37 Q1.3 ; 光敏电阻.1 30.6,72.28 30.69,72.37 ; 45.73,72.37 45.72,72.36 气体传感器.4
  Bottom Layer w1.5: 驱动总开关.1 61.64,60.85 50.13,72.37 18.45,72.37 DHT11.1
VCC_Q: length 68.1
  Top Layer w1: Q6.1 20.69,19.64 19.39,20.93 19.39,26 R9.2
  Bottom Layer w1.5: 38.08,25.63 38.08,29.06 C2.1
  Bottom Layer w2: 驱动总开关.2 56.64,20.89 51.65,25.89 38.33,25.89 38.08,25.63 ; 38.08,25.63 37.82,25.89 24.23,25.89 R9.2 ; 38.08,25.63 38.08,22.19 U11.4
$1N3228: length 17.7
  Top Layer w1: STM32.33 37.94,68.37 气体传感器.1
$1N3444: length 10
  Top Layer w1: Q1.2 72.16,58.42 R3.2
$1N3528: length 17.2
  Top Layer w1: Q1.1 蜂鸣器.1 79.41,65.62 R4.2
$1N3532: length 10.7
  Top Layer w1: LED2.2 91.91,63.62 R4.1
$1N3767: length 39.7
  Top Layer w1: OLED.3 83.18,49.15 81.42,50.91 53.73,50.91 50.95,53.69 50.95,55.99
$1N3771: length 39.6
  Top Layer w1: STM32.22 53.49,54.26 54.17,53.57 81.75,53.57 85.72,49.61 OLED.4
$1N3839: length 18.4
  Top Layer w1: R3.1 60.79,68.37 STM32.24
$1N4349: length 100
  Top Layer w1: STM32.1 15.78,48.75 60.16,48.75 89.62,19.28 89.62,16.65 SWITCH.2
$1N4353: length 89.4
  Top Layer w1: STM32.2 16.16,46.59 58.51,46.59 79.72,25.38 79.72,16.68 +.2
$1N4357: length 78.9
  Top Layer w1: -.2 69.56,16.71 69.56,32.11 57.24,44.43 16.54,44.43 STM32.3
$1N4558: length 30.1
  Bottom Layer w1: DHT11.2 14.06,66.21 14.06,44.62 STM32.5
$1N4725: length 24.9
  Top Layer w1: STM32.6 16.67,36.94 3.26,36.94 2.12,35.79 2.12,34.07 WIFI.4
$1N4730: length 13.8
  Top Layer w1: STM32.7 16.91,34.64 WIFI.5
$1N5233: length 8.1
  Top Layer w1: R10.2 24.09,20.93 24.09,18.52 23.94,18.37 Q6.2
$1N5238: length 13.2
  Top Layer w1: Q5.3 32.95,17.09 33.62,17.76 33.62,21.9 R10.1 32.06,23.47 R9.1
$1N5242: length 21
  Top Layer w1: R11.2 23.47,33.37 26.89,29.95 26.89,22.28 30.81,18.37 Q5.2
$1N6355: length 16.4
  Top Layer w1: R11.1 39.57,33.37 43.34,37.13 STM32.15
$1N6554: length 14.1
  Top Layer w1: 光敏电阻.2 27.2,65.32 电位器.3 23.02,61.13 STM32.34
$1N12132: length 4
  Top Layer w1: LED.1 21.91,15.2 Q6.3
$1N15975: length 18.6
  Top Layer w1: STM32.16 45.72,40.59 U11.1
$1N16897: length 13.2
  Top Layer w1: 马达1.2 43.18,5.59 U11.7 U11.8
$1N16901: length 13.2
  Top Layer w1: 马达1.1 40.63,5.59 U11.6 U11.5

## Copper pours and planes (outline as drawn; the poured copper is in the pictures)
GND on Top Layer: -6.52,-8.15 105.5,-8.15 105.5,86.34 -6.52,86.34
GND on Top Layer: 49.75,54.08 60.79,54.08 60.79,50.4 49.75,50.4
GND on Top Layer: 50.51,55.22 54,55.22 54,53.95 50.51,53.95

Small or netless copper shapes (teardrops, artwork), in the pictures only: 1 on Top Layer, 9 on Bottom Layer

## Text on the board
Top Silkscreen Layer: JLCJLCJLCJLC | LINK
